# EasyEDA Pro project 烟雾报警.eprj

# Schematic 透传报警原理图
Board Name: Board2; Create Date: 2025-03-01; Company: 重庆理工大学; Drawed: 吴振伟
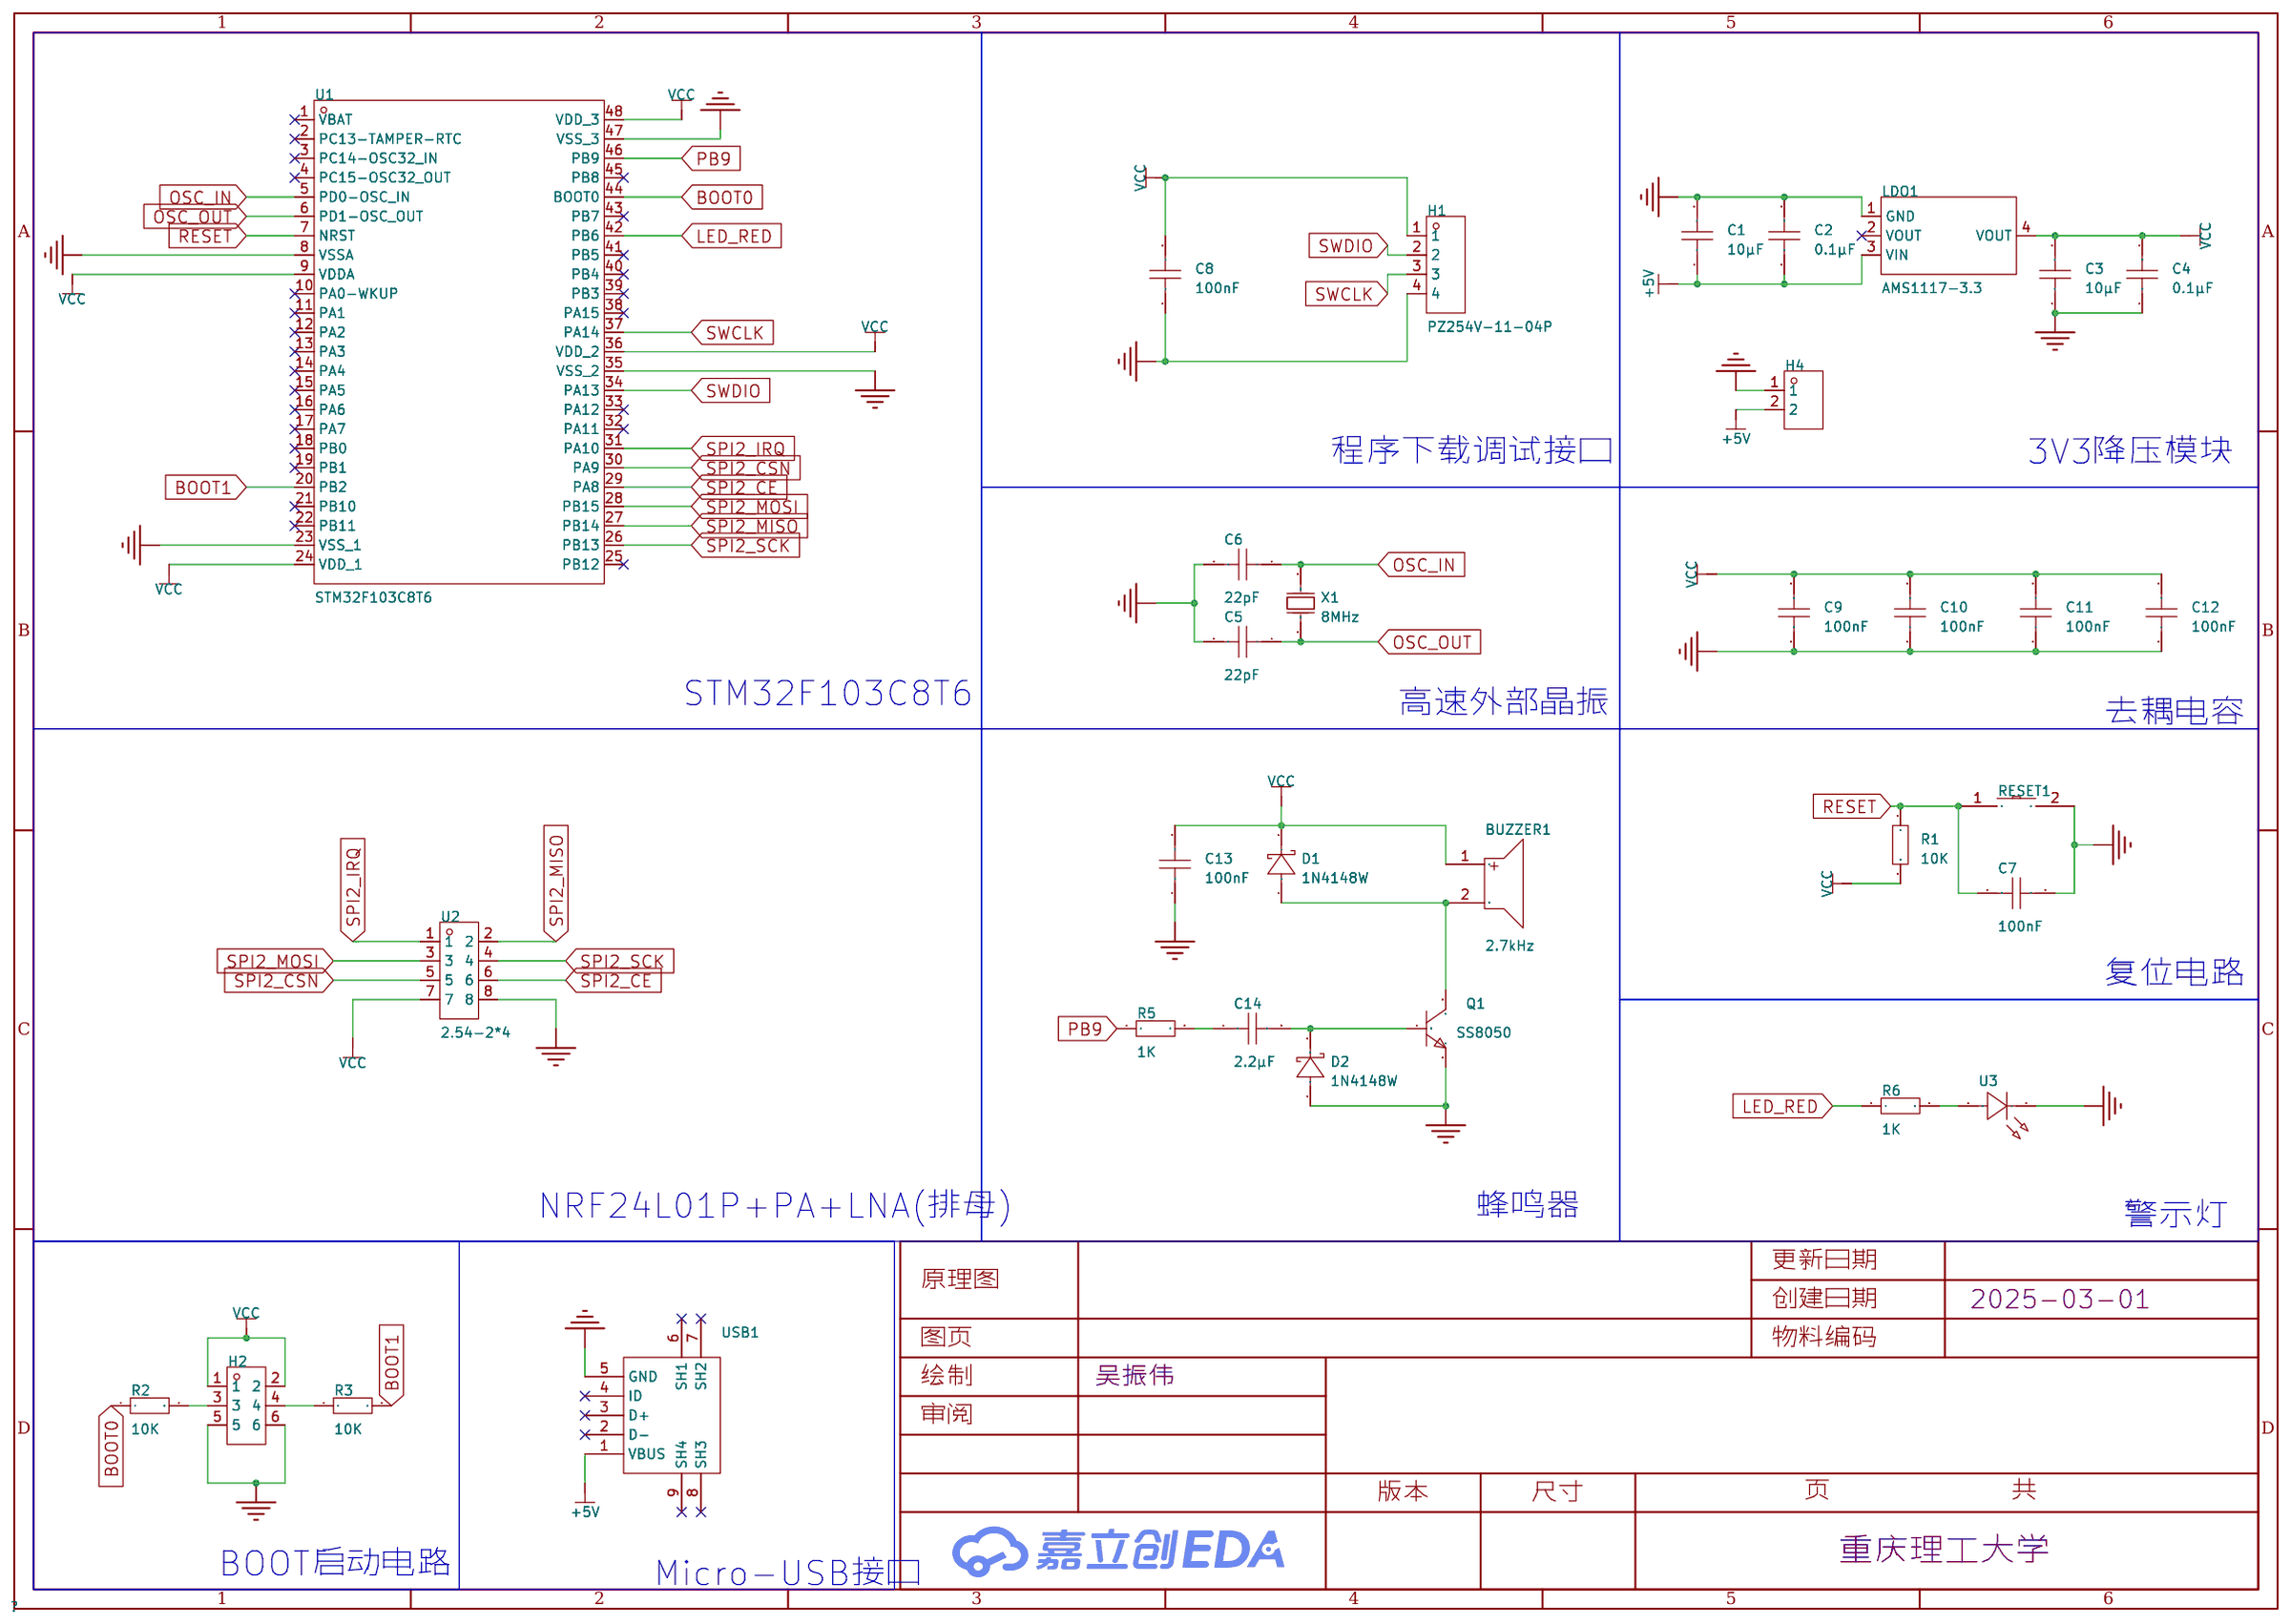
[diagram p0: schematic sheet]

## Parts
BUZZER1  2.7kHz  [BUZ-TH_BD9.0-P4.00-D0.6-FD]
C1  10μF  [C0603]
C2  0.1μF  [C0603]
C3  10μF  [C0603]
C4  0.1μF  [C0603]
C5  22pF  [C0603]
C6  22pF  [C0603]
C7  100nF  [C0603]
C8  100nF  [C0603]
C9  100nF  [C0603]
C10  100nF  [C0603]
C11  100nF  [C0603]
C12  100nF  [C0603]
C13  100nF  [C0603]
C14  2.2μF  [C0603]
D1  1N4148W  [SOD-123_L2.7-W1.6-LS3.7-FD]
D2  1N4148W  [SOD-123_L2.7-W1.6-LS3.7-FD]
H1  PZ254V-11-04P  [HDR-TH_4P-P2.54-V-M]
H2  PZ2.54-2x3-11.2  [HDR-TH_6P-P2.54-V-M-R2-C3-S2.54]
H4  PZ254V-11-02P  [HDR-TH_2P-P2.54-V-M]
LDO1  AMS1117-3.3  [SOT-223-3_L6.5-W3.4-P2.30-LS7.0-BR]
Q1  SS8050  [SOT-23-3_L2.9-W1.3-P1.90-LS2.4-BR]
R1  10K  [R0603]
R2  10K  [R0603]
R3  10K  [R0603]
R5  1K  [R0603]
R6  1K  [R0603]
RESET1  TS-1101-C-W  [SW-SMD_L6.0-W3.3-LS8.0]
U1  STM32F103C8T6  [LQFP-48_L7.0-W7.0-P0.50-LS9.0-BL]
U2  2.54-2*4  [HDR-TH_8P-P2.54-V-F-R2-C4-S2.54]
U3  XL-TD2012SURC  [LED0805-RD_RED]
USB1  MicroXNJ  [MICRO-USB-SMD_MICROXNJ]
X1  8MHz  [CRYSTAL-SMD_L5.0-W3.2]

## Library data of the parts
BUZZER1 = QMB-09B-03: 驱动方式:无源(外部驱动);构造类型:电磁式;频率:2.7kHz;声压(SPL):85dB;; LCSC Part Name: 无源蜂鸣器QMB-09B-03; Supplier Part: C96256; Manufacturer: 华能; Supplier Footprint: 插件,D=9mm; JLCPCB Part Class: 扩展库; Datasheet: https://atta.szlcsc.com/upload/public/pdf/source/20210401/C96256_958B17753B5AD7CBFBCFFC7C095B4484.pdf; Supplier: LCSC; Driver Circuitry: 无源(外部驱动); Technology: 电磁式; Voltage - Supply: 2V~5V; Sound Pressure Level(SPL): 85dB; Diameter(φD): 9mm; Height: 5.7mm
C1-C14 = CAP_0603: Supplier Footprint: 0603
D1 D2 = 1N4148W_C7420318: 二极管配置:独立式;正向压降(Vf):1.25V@150mA;直流反向耐压(Vr):100V;整流电流:150mA;反向恢复时间(trr):4ns;; Supplier Part: C7420318; Manufacturer: 宏迦橙; Supplier Footprint: SOD-123; JLCPCB Part Class: 扩展库; Datasheet: https://atta.szlcsc.com/upload/public/pdf/source/20230828/E5C3F7A4272052930A7E03B75759BF50.pdf; Supplier: LCSC; Diode Configuration: 独立式; Forward Voltage (Vf@If): 1.25V@150mA; Reverse Voltage (Vr): 100V; Rectified Current: 150mA; Reverse Leakage Current (Ir): 1uA@75V; Reverse Recovery Time (trr): 4ns; Operating Temperature: -55℃~+150℃
H1 = PZ254V-11-04P: 插针结构:1x4P;间距:2.54mm;行距:-;圆针/方针:方针;安装类型:直插;排数:单排;总PIN位数:4P;额定电流:3A;额定电压:250V;配合针长度:6mm;塑高:2.5mm;端接针长度:3mm;触头材质:-;工作温度范围:-40℃~+105℃;颜色:黑色;; LCSC Part Name: 间距:2.54mm 1x4P 直插 方针; Supplier Part: C2691448; Manufacturer: XFCN(兴飞); Supplier Footprint: 插件,P=2.54mm; JLCPCB Part Class: 扩展库; Datasheet: https://atta.szlcsc.com/upload/public/pdf/source/20200309/C492403_F9F19131791D08044AD4F84F8E751A34.pdf; Supplier: LCSC; Pin Structure: 1x4P; Pitch: 2.54mm; Circluar Pins/Square Pins: 方针; Mounting Type: 直插; Number of Rows: 单排; Number of Pins: 4P; Current Rating (Max): 3A; Voltage Rating (Max): 250V; Length of Mating Pin: 6mm; Insulation Height: 2.5mm; Length of End Connection Pin: 3mm; Operating Temperature Range: -40℃~+105℃; Color: 黑色
H2 = PZ2.54-2x3-11.2: LCSC Part Name: 排针 2*3 2.54 11.2MM; Supplier Part: C29779988; Manufacturer: ZHOURI(洲日); Supplier Footprint: 插件,P=2.54mm; JLCPCB Part Class: 扩展库; Datasheet: https://atta.szlcsc.com/upload/public/pdf/source/20240716/32C05CE2216495DDDE0C72C1E62EDEE1.pdf; Supplier: LCSC
H4 = PZ254V-11-02P: 插针结构:1x2P;间距:2.54mm;行距:-;圆针/方针:方针;安装类型:直插;排数:单排;总PIN位数:2P;额定电流:-;额定电压:-;配合针长度:6mm;塑高:2.5mm;端接针长度:3mm;触头材质:黄铜;触头镀层:-;工作温度范围:-40℃~+105℃;颜色:黑色;; LCSC Part Name: 间距:2.54mm 1x2P 直插 方针; Supplier Part: C492401; Manufacturer: XFCN(兴飞); Supplier Footprint: 插件,P=2.54mm; JLCPCB Part Class: 扩展库; Datasheet: https://atta.szlcsc.com/upload/public/pdf/source/20200309/C492401_A812433581A9B211A7FFA413ADDFF0E5.pdf; Supplier: LCSC; Pin Structure: 1x2P; Pitch: 2.54mm; Circluar Pins/Square Pins: 方针; Mounting Type: 直插; Number of Rows: 单排; Number of Pins: 2P; Length of Mating Pin: 6mm; Insulation Height: 2.5mm; Length of End Connection Pin: 3mm; Contact Material: 黄铜; Operating Temperature Range: -40℃~+105℃; Color: 黑色
LDO1 = AMS1117-3.3_C6186: 输出类型:固定;工作电压:-;输出电压:3.3V;输出电流:1A;电源纹波抑制比(PSRR):72dB@(120Hz);输出极性:正极;; LCSC Part Name: 输出3.3V 1A; Supplier Part: C6186; Manufacturer: AMS; Supplier Footprint: SOT-223; JLCPCB Part Class: 基础库; Datasheet: https://atta.szlcsc.com/upload/public/pdf/source/20180727/C6186_7A095716F0823C02F1997A905E26C086.pdf; Supplier: LCSC; Output Type: 固定; Output Voltage: 3.3V; Output Current: 1A; Power Supply Rejection Ratio (PSRR): 72dB@(120Hz); Voltage Dropout: 1.3V@(800mA); Features: 过流保护(OCP)；热保护(TSD); Output Configuration: 正极; Number of Outputs: 1
Q1 = SS8050_C7420370: 晶体管类型:NPN;集电极电流(Ic):1.5A;集射极击穿电压(Vceo):25V;耗散功率(Pd):300mW;直流电流增益(hFE):120@100mA,1.0V;; LCSC Part Name: H档 200-350; Supplier Part: C7420370; Manufacturer: 宏嘉诚; Supplier Footprint: SOT-23; JLCPCB Part Class: 扩展库; Datasheet: https://atta.szlcsc.com/upload/public/pdf/source/20250205/5DB94E86981B5B1A1866D18E379C0D4F.pdf; Supplier: LCSC; type: NPN; Current - Collector(Ic): 1.5A; Collector - Emitter Voltage VCEO: 25V; Pd - Power Dissipation: 300mW; DC Current Gain: 120@100mA,1.0V; Transition frequency(fT): 100MHz; Current - Collector Cutoff: 100nA; Vce Saturation(VCE(sat)): 500mV; Operating Temperature: -55℃~+150℃
R1-R3 R5 R6 = Res_0603: Supplier Footprint: 0603
RESET1 = TS-1101-C-W: 电路结构:单刀单掷;按钮形状:矩形按钮;作用力:260gf;安装方式:立贴;开关长度:6mm;开关宽度:3.6mm;开关高度:2.5mm;带支架:不带;触点电流:50mA;额定电压(AC):-;额定电压(DC):12V;额定功率:-;绝缘电阻:-;带灯:无;机械寿命:5万次;; LCSC Part Name: 6*3.6*2.5mm 立贴 轻触开关; Supplier Part: C318938; Manufacturer: XKB Connectivity(中国星坤); Supplier Footprint: SMD; JLCPCB Part Class: 扩展库; Datasheet: https://atta.szlcsc.com/upload/public/pdf/source/20200227/C318938_C2E53B1EEDE37D980A33616AC086DE53.pdf; Supplier: LCSC; Circuit: 单刀单掷; Actuator Style: 矩形按钮; Operating Force: 260gf; Mounting Style: 立贴; Switch Length: 6mm; Switch Width: 3.6mm; Switch Height: 2.5mm; Strike Gundam: 不带; Contact Current: 50mA; Voltage Rating (DC): 12V; Actuator/Cap Color: 白色带淡绿; With Lamp: 无; Mechanical Life: 5万次; Operating Temperature: -30℃~+85℃
U1 = STM32F103C8T6: CPU内核:ARM-M3;CPU最大主频:72MHz;应用领域:-;; LCSC Part Name: 主流增强型ARM Cortex-M3 MCU，具有64 KB Flash、72 MHz CPU、电机控制、USB和CAN; Supplier Part: C8734; Manufacturer: ST(意法半导体); Supplier Footprint: LQFP-48(7x7); JLCPCB Part Class: 扩展库; Datasheet: https://atta.szlcsc.com/upload/public/pdf/source/20220812/8363ACEC51AD55ECEB84799464F7CB85.pdf; Supplier: LCSC; CPU Core: ARM-M3; CPU Maximum Speed: 72MHz; Program Storage Size: 64KB; Program Memory Type: FLASH; Number of I/O: 37; ADC (Bit): 12bit; Low Voltage Detection Threshold: 2V~3.6V
U2 = 2.54-2*4: 插孔结构:2x4P;间距:2.54mm;行距:2.54mm;圆孔/方孔:方孔;安装类型:直插;排数:双排;总孔位数:8P;额定电流:2.5A;额定电压:-;插孔方向:顶部;塑高:8.5mm;工作温度范围:-40℃~+105℃;; LCSC Part Name: 间距:2.54mm 2x4P 直插; Supplier Part: C2977588; Manufacturer: ZHOURI(洲日); Supplier Footprint: 插件,P=2.54mm; JLCPCB Part Class: 扩展库; Datasheet: https://atta.szlcsc.com/upload/public/pdf/source/20220328/363EB391BC0EB759CF231FC910753CBE.pdf; Supplier: LCSC; Holes Structure: 2x4P; Pitch: 2.54mm; Row Spacing: 2.54mm; Circular Hole / Square Hole: 方孔; Mounting Type: 直插; Number of Rows: 双排; Number of Holes: 8P; Current Rating (Max): 2.5A; Holes Direction: 顶部; Insulation Height: 8.5mm; Operating Temperature Range: -40℃~+105℃
U3 = XL-TD2012SURC: 发光颜色:红色;正向电压(VF):1.9V~2.1V;功率:55mW;正向电流:5mA;主波长:620nm~630nm;透镜颜色:无色透明透镜;发光强度:400mcd;发光角度:30°;载带方式:正贴;工作温度:-30℃~+85℃;; LCSC Part Name: 球头红; Supplier Part: C5349939; Manufacturer: XINGLIGHT(成兴光); Supplier Footprint: 0805; JLCPCB Part Class: 扩展库; Datasheet: https://atta.szlcsc.com/upload/public/pdf/source/20240218/894FF46C8AEFE14406D7194D5A29CE65.pdf; Supplier: LCSC; Emitted Color: 红色; Forward Voltage (VF): 1.9V~2.1V; Power Dissipation: 55mW; Forward Current: 5mA; Dominant Wavelength: 620nm~630nm; Lens Color: 无色透明透镜; Luminous Intensity: 400mcd; Viewing Angle: 30°; Mounting Sytle: 正贴; Operating Temperature: -30℃~+85℃
USB1 = MicroXNJ: 连接器类型:Micro-B;标准:USB 2.0;公母:母;安装方式:卧贴;触点数量:5P;端口数量:1;额定电流 - 电源:1.8A;工作温度范围:-20℃~+85℃;; LCSC Part Name: Micro-B 母 卧贴; Supplier Part: C404969; Manufacturer: SHOU HAN(首韩); Supplier Footprint: SMD; JLCPCB Part Class: 扩展库; Datasheet: https://atta.szlcsc.com/upload/public/pdf/source/20220415/2494EDFF499AF6F852F7C820374B6AF3.pdf; Supplier: LCSC; Connector Type: Micro-B; Standard: USB 2.0; Gender: 母; Mounting Style: 卧贴; Number of Contacts: 5P; Number of Ports: 1; Current Rating - Power (Max): 1.8A; Operating Temperature Range: -20℃~+85℃; Rated Voltage (Max): 30V; Connect-Disconnect Life: 5千次; Core Colour: 黑色
X1 = X50328MSB2GI: 晶振类型:贴片晶振;频率:8MHz;常温频差:±10ppm;负载电容:20pF;频率稳定度:±20ppm;; LCSC Part Name: 8MHz ±10ppm 20pF; Supplier Part: C115962; Manufacturer: YXC(扬兴晶振); Supplier Footprint: SMD5032; JLCPCB Part Class: 基础库; Datasheet: https://atta.szlcsc.com/upload/public/pdf/source/20240329/44922B0AF7B60E58E9B66993B6077277.pdf; Supplier: LCSC; Type: 贴片晶振; Normal temperature Frequency Tolerance: ±10ppm; Load Capacitance: 20pF; Frequency Stability: ±20ppm; Operating Temperature: -40℃~+85℃

## Nets
+5V: C1.1 C2.1 H4.2 LDO1.3(VIN) USB1.1(VBUS)
GND: C1.2 C2.2 C3.1 C4.1 C5.2 C6.2 C7.2 C8.1 C9.1 C10.1 C11.1 C12.1 C13.1 D2.1(A) H1.4 H2.5 H2.6 H4.1 LDO1.1(GND) Q1.2(E) RESET1.2 U1.8(VSSA) U1.23(VSS_1) U1.35(VSS_2) U1.47(VSS_3) U2.8 U3.1(K) USB1.5(GND)
VCC: BUZZER1.1 C3.2 C4.2 C8.2 C9.2 C10.2 C11.2 C12.2 C13.2 D1.2(K) H1.1 H2.1 H2.2 LDO1.4(VOUT) R1.2 U1.9(VDDA) U1.24(VDD_1) U1.36(VDD_2) U1.48(VDD_3) U2.7
BOOT0: R2.1 U1.44(BOOT0)
BOOT1: R3.2 U1.20(PB2)
LED_RED: R6.1 U1.42(PB6)
OSC_IN: C6.1 U1.5(PD0-OSC_IN) X1.2(OSC2)
OSC_OUT: C5.1 U1.6(PD1-OSC_OUT) X1.1(OSC1)
PB9: R5.1 U1.46(PB9)
RESET: C7.1 R1.1 RESET1.1 U1.7(NRST)
SPI2_CE: U1.29(PA8) U2.6
SPI2_CSN: U1.30(PA9) U2.5
SPI2_IRQ: U1.31(PA10) U2.1
SPI2_MISO: U1.27(PB14) U2.2
SPI2_MOSI: U1.28(PB15) U2.3
SPI2_SCK: U1.26(PB13) U2.4
SWCLK: H1.3 U1.37(PA14)
SWDIO: H1.2 U1.34(PA13)
$1N1293: H2.3 R2.2
$1N1294: H2.4 R3.1
$1N1742: BUZZER1.2 D1.1(A) Q1.3(C)
$1N1744: C14.1 R5.2
$1N1746: C14.2 D2.2(K) Q1.1(B)
$1N2216: R6.2 U3.2(A)

Not connected (* = marked no-connect by the designer): LDO1 2(VOUT)*; U1 1(VBAT)* 2(PC13-TAMPER-RTC)* 3(PC14-OSC32_IN)* 4(PC15-OSC32_OUT)* 10(PA0-WKUP)* 11(PA1)* 12(PA2)* 13(PA3)* 14(PA4)* 15(PA5)* 16(PA6)* 17(PA7)* 18(PB0)* 19(PB1)* 21(PB10)* 22(PB11)* 25(PB12)* 32(PA11)* 33(PA12)* 38(PA15)* 39(PB3)* 40(PB4)* 41(PB5)* 43(PB7)* 45(PB8)*; USB1 2(D-)* 3(D+)* 4(ID)* 6(SH1)* 7(SH2)* 8(SH3)* 9(SH4)*

## Notes on the sheet
- 程序下载调试接口
- 3V3降压模块
- STM32F103C8T6
- 高速外部晶振
- 去耦电容
- 复位电路
- NRF24L01P+PA+LNA(排母)
- 蜂鸣器
- 警示灯
- BOOT启动电路
- Micro-USB接口

# Schematic 检测模块原理图
Board Name: Board1; Create Date: 2025-03-01; Company: 重庆理工大学; Drawed: 吴振伟
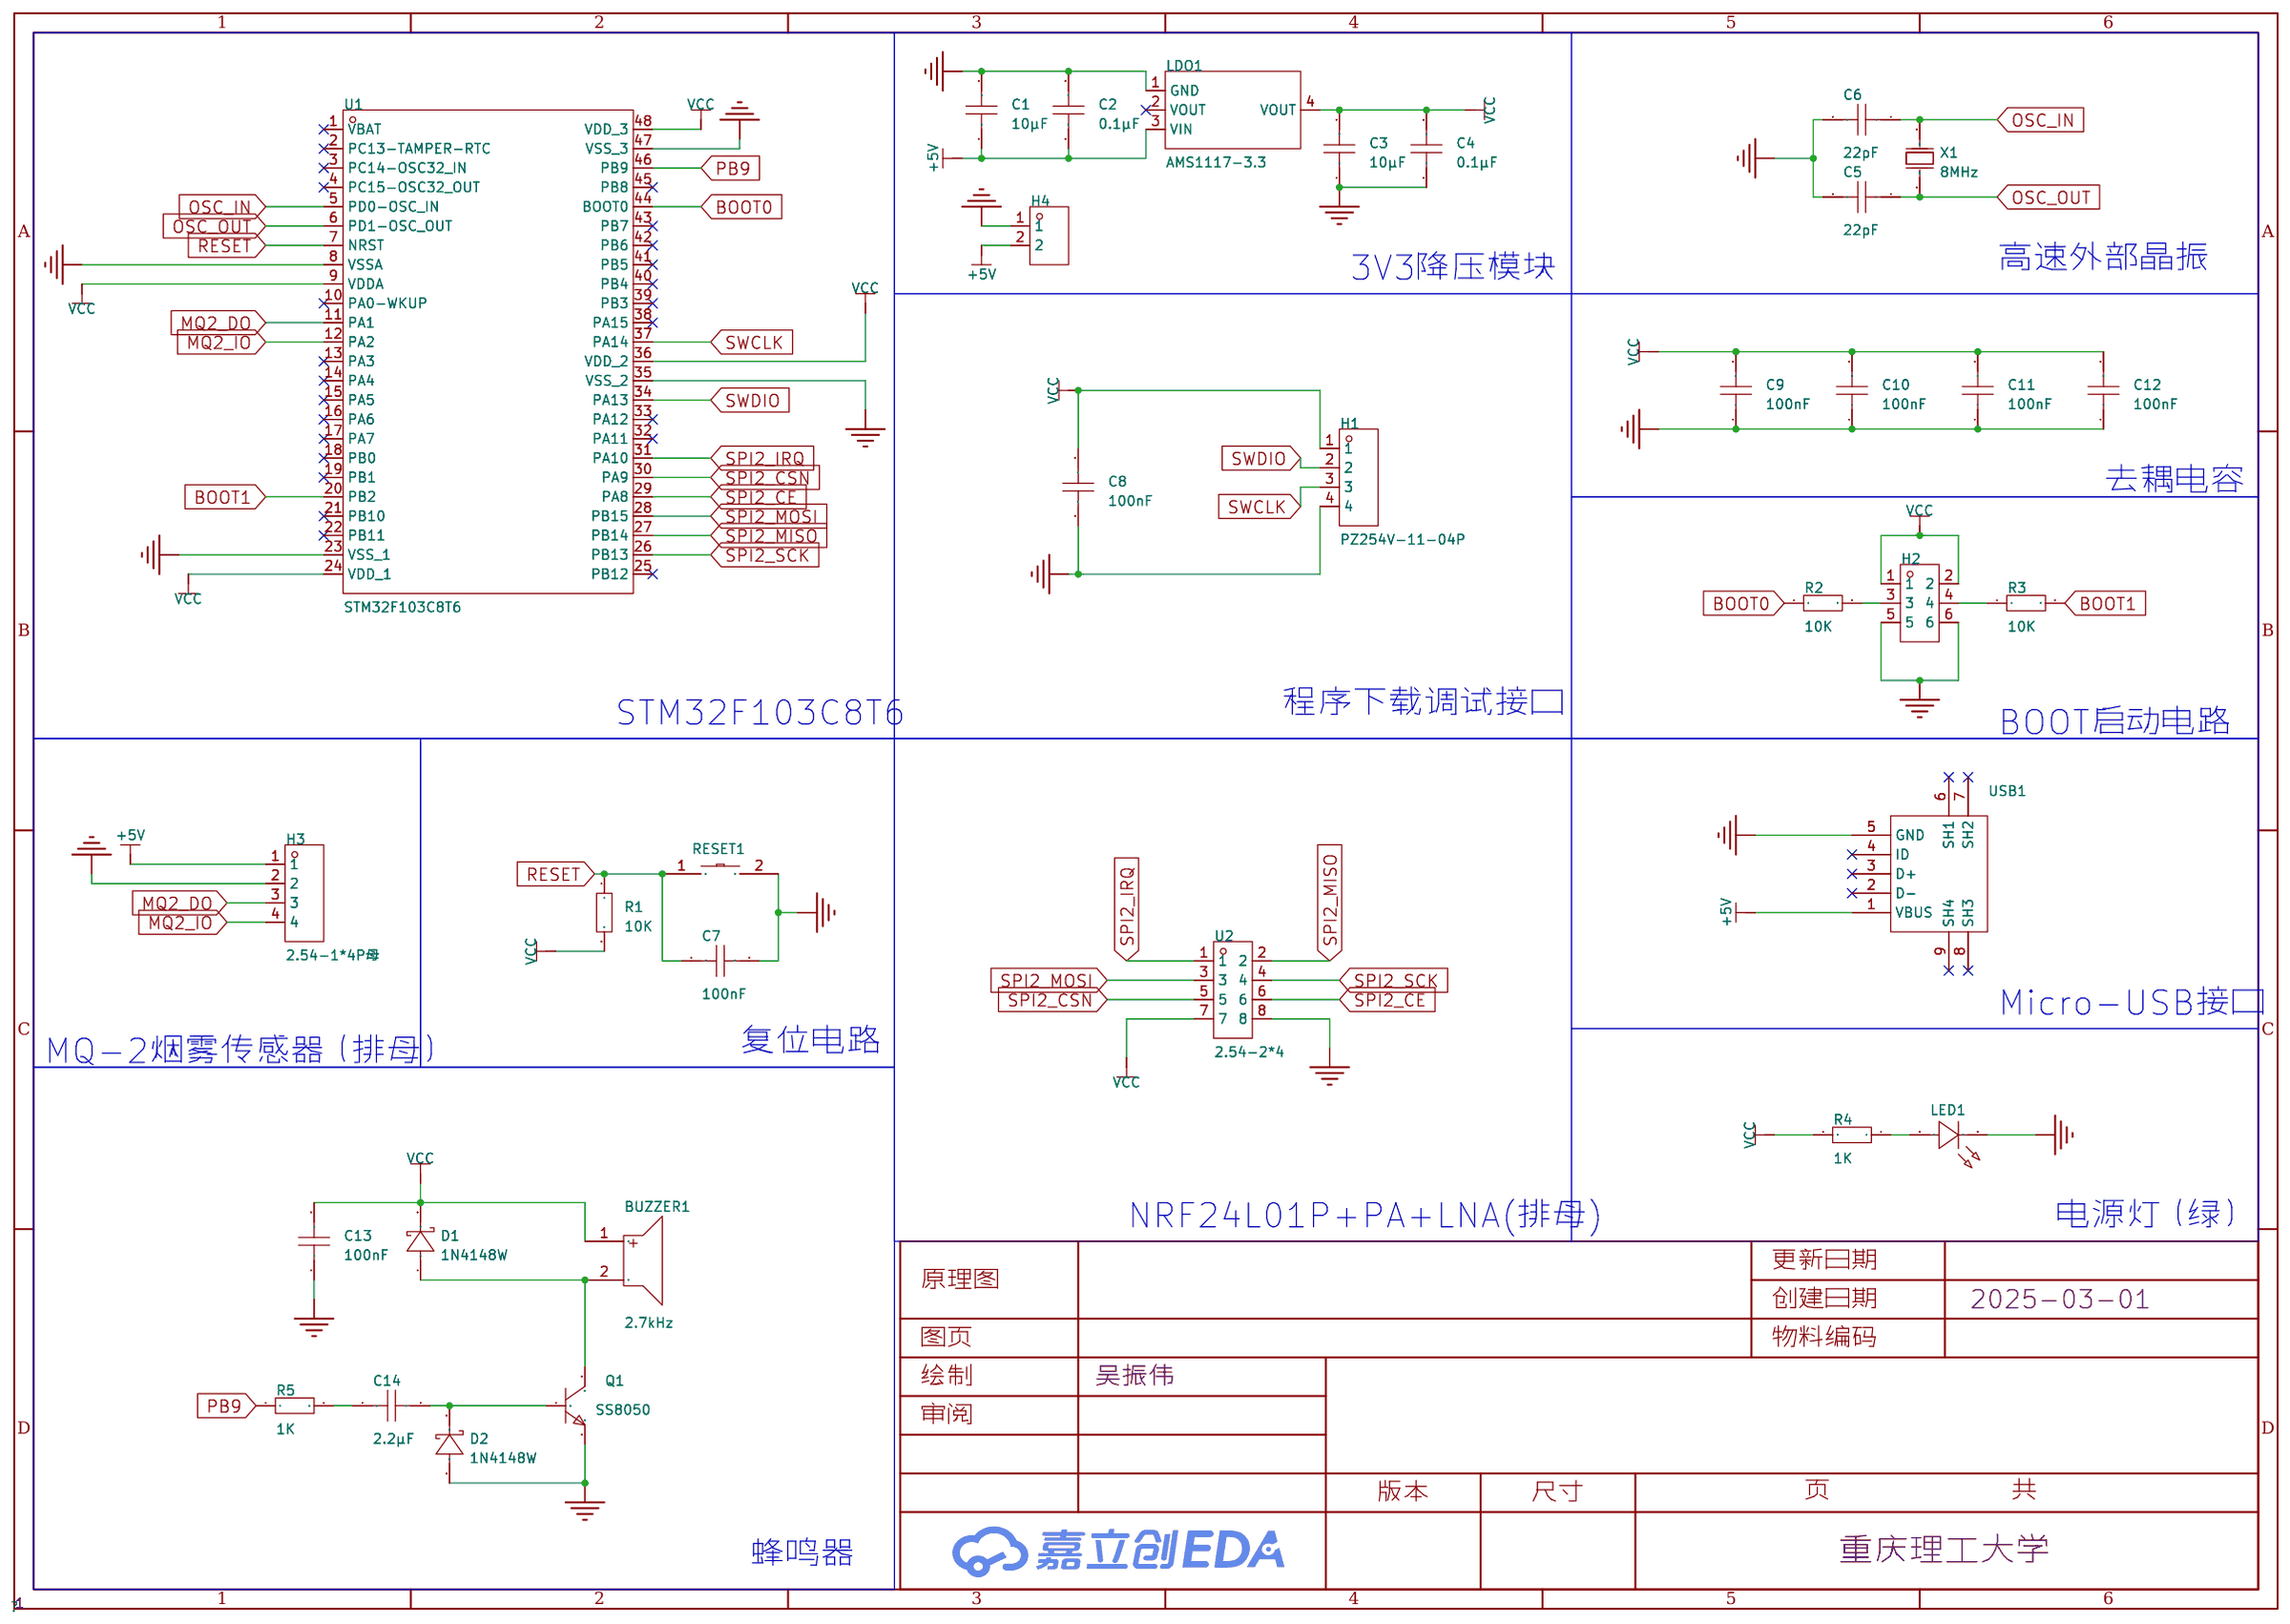
[diagram p1: schematic sheet]

## Parts
BUZZER1  2.7kHz  [BUZ-TH_BD9.0-P4.00-D0.6-FD]
C1  10μF  [C0603]
C2  0.1μF  [C0603]
C3  10μF  [C0603]
C4  0.1μF  [C0603]
C5  22pF  [C0603]
C6  22pF  [C0603]
C7  100nF  [C0603]
C8  100nF  [C0603]
C9  100nF  [C0603]
C10  100nF  [C0603]
C11  100nF  [C0603]
C12  100nF  [C0603]
C13  100nF  [C0603]
C14  2.2μF  [C0603]
D1  1N4148W  [SOD-123_L2.7-W1.6-LS3.7-FD]
D2  1N4148W  [SOD-123_L2.7-W1.6-LS3.7-FD]
H1  PZ254V-11-04P  [HDR-TH_4P-P2.54-V-M]
H2  PZ2.54-2x3-11.2  [HDR-TH_6P-P2.54-V-M-R2-C3-S2.54]
H3  2.54-1*4P母  [HDR-TH_4P-P2.54-V-F]
H4  PZ254V-11-02P  [HDR-TH_2P-P2.54-V-M]
LDO1  AMS1117-3.3  [SOT-223-3_L6.5-W3.4-P2.30-LS7.0-BR]
LED1  XL-302UGD  [LED-TH_BD3.8-P2.54-FD_GREEN]
Q1  SS8050  [SOT-23-3_L2.9-W1.3-P1.90-LS2.4-BR]
R1  10K  [R0603]
R2  10K  [R0603]
R3  10K  [R0603]
R4  1K  [R0603]
R5  1K  [R0603]
RESET1  TS-1101-C-W  [SW-SMD_L6.0-W3.3-LS8.0]
U1  STM32F103C8T6  [LQFP-48_L7.0-W7.0-P0.50-LS9.0-BL]
U2  2.54-2*4  [HDR-TH_8P-P2.54-V-F-R2-C4-S2.54]
USB1  MicroXNJ  [MICRO-USB-SMD_MICROXNJ]
X1  8MHz  [CRYSTAL-SMD_L5.0-W3.2]

## Library data of the parts
BUZZER1 = QMB-09B-03: 驱动方式:无源(外部驱动);构造类型:电磁式;频率:2.7kHz;声压(SPL):85dB;; LCSC Part Name: 无源蜂鸣器QMB-09B-03; Supplier Part: C96256; Manufacturer: 华能; Supplier Footprint: 插件,D=9mm; JLCPCB Part Class: 扩展库; Datasheet: https://atta.szlcsc.com/upload/public/pdf/source/20210401/C96256_958B17753B5AD7CBFBCFFC7C095B4484.pdf; Supplier: LCSC; Driver Circuitry: 无源(外部驱动); Technology: 电磁式; Voltage - Supply: 2V~5V; Sound Pressure Level(SPL): 85dB; Diameter(φD): 9mm; Height: 5.7mm
C1-C14 = CAP_0603: Supplier Footprint: 0603
D1 D2 = 1N4148W_C7420318: 二极管配置:独立式;正向压降(Vf):1.25V@150mA;直流反向耐压(Vr):100V;整流电流:150mA;反向恢复时间(trr):4ns;; Supplier Part: C7420318; Manufacturer: 宏迦橙; Supplier Footprint: SOD-123; JLCPCB Part Class: 扩展库; Datasheet: https://atta.szlcsc.com/upload/public/pdf/source/20230828/E5C3F7A4272052930A7E03B75759BF50.pdf; Supplier: LCSC; Diode Configuration: 独立式; Forward Voltage (Vf@If): 1.25V@150mA; Reverse Voltage (Vr): 100V; Rectified Current: 150mA; Reverse Leakage Current (Ir): 1uA@75V; Reverse Recovery Time (trr): 4ns; Operating Temperature: -55℃~+150℃
H1 = PZ254V-11-04P: 插针结构:1x4P;间距:2.54mm;行距:-;圆针/方针:方针;安装类型:直插;排数:单排;总PIN位数:4P;额定电流:3A;额定电压:250V;配合针长度:6mm;塑高:2.5mm;端接针长度:3mm;触头材质:-;工作温度范围:-40℃~+105℃;颜色:黑色;; LCSC Part Name: 间距:2.54mm 1x4P 直插 方针; Supplier Part: C2691448; Manufacturer: XFCN(兴飞); Supplier Footprint: 插件,P=2.54mm; JLCPCB Part Class: 扩展库; Datasheet: https://atta.szlcsc.com/upload/public/pdf/source/20200309/C492403_F9F19131791D08044AD4F84F8E751A34.pdf; Supplier: LCSC; Pin Structure: 1x4P; Pitch: 2.54mm; Circluar Pins/Square Pins: 方针; Mounting Type: 直插; Number of Rows: 单排; Number of Pins: 4P; Current Rating (Max): 3A; Voltage Rating (Max): 250V; Length of Mating Pin: 6mm; Insulation Height: 2.5mm; Length of End Connection Pin: 3mm; Operating Temperature Range: -40℃~+105℃; Color: 黑色
H2 = PZ2.54-2x3-11.2: LCSC Part Name: 排针 2*3 2.54 11.2MM; Supplier Part: C29779988; Manufacturer: ZHOURI(洲日); Supplier Footprint: 插件,P=2.54mm; JLCPCB Part Class: 扩展库; Datasheet: https://atta.szlcsc.com/upload/public/pdf/source/20240716/32C05CE2216495DDDE0C72C1E62EDEE1.pdf; Supplier: LCSC
H3 = 2.54-1*4P母: 插孔结构:1x4P;间距:2.54mm;行距:-;圆孔/方孔:方孔;安装类型:直插;排数:单排;总孔位数:4P;额定电流:3A;额定电压:-;插孔方向:顶部;塑高:-;触头材质:青铜;触头镀层:-;工作温度范围:-40℃~+105℃;焊接温度(最大值):-;; LCSC Part Name: 间距:2.54mm 1x4P 直插; Supplier Part: C2718488; Manufacturer: BOOMELE(博穆精密); Supplier Footprint: 插件,P=2.54mm; JLCPCB Part Class: 扩展库; Datasheet: https://atta.szlcsc.com/upload/public/pdf/source/20210301/C2718488_F4427B881E42CAA8DDB0B1C12B3A522C.pdf; Supplier: LCSC; Holes Structure: 1x4P; Pitch: 2.54mm; Circular Hole / Square Hole: 方孔; Mounting Type: 直插; Number of Rows: 单排; Number of Holes: 4P; Current Rating (Max): 3A; Holes Direction: 顶部; Contact Material: 青铜; Operating Temperature Range: -40℃~+105℃
H4 = PZ254V-11-02P: 插针结构:1x2P;间距:2.54mm;行距:-;圆针/方针:方针;安装类型:直插;排数:单排;总PIN位数:2P;额定电流:-;额定电压:-;配合针长度:6mm;塑高:2.5mm;端接针长度:3mm;触头材质:黄铜;触头镀层:-;工作温度范围:-40℃~+105℃;颜色:黑色;; LCSC Part Name: 间距:2.54mm 1x2P 直插 方针; Supplier Part: C492401; Manufacturer: XFCN(兴飞); Supplier Footprint: 插件,P=2.54mm; JLCPCB Part Class: 扩展库; Datasheet: https://atta.szlcsc.com/upload/public/pdf/source/20200309/C492401_A812433581A9B211A7FFA413ADDFF0E5.pdf; Supplier: LCSC; Pin Structure: 1x2P; Pitch: 2.54mm; Circluar Pins/Square Pins: 方针; Mounting Type: 直插; Number of Rows: 单排; Number of Pins: 2P; Length of Mating Pin: 6mm; Insulation Height: 2.5mm; Length of End Connection Pin: 3mm; Contact Material: 黄铜; Operating Temperature Range: -40℃~+105℃; Color: 黑色
LDO1 = AMS1117-3.3_C6186: 输出类型:固定;工作电压:-;输出电压:3.3V;输出电流:1A;电源纹波抑制比(PSRR):72dB@(120Hz);输出极性:正极;; LCSC Part Name: 输出3.3V 1A; Supplier Part: C6186; Manufacturer: AMS; Supplier Footprint: SOT-223; JLCPCB Part Class: 基础库; Datasheet: https://atta.szlcsc.com/upload/public/pdf/source/20180727/C6186_7A095716F0823C02F1997A905E26C086.pdf; Supplier: LCSC; Output Type: 固定; Output Voltage: 3.3V; Output Current: 1A; Power Supply Rejection Ratio (PSRR): 72dB@(120Hz); Voltage Dropout: 1.3V@(800mA); Features: 过流保护(OCP)；热保护(TSD); Output Configuration: 正极; Number of Outputs: 1
LED1 = XL-302UGD: 灯头类型:3mm圆形灯头;发光颜色:翠绿色;功率:80mW;正向电流:30mA;主波长:510nm~520nm;透镜颜色:绿色透镜;色温:-;发光角度:50°;载带方式:-;工作温度:-25℃~+85℃;; Supplier Part: C2895476; Manufacturer: XINGLIGHT(成兴光); Supplier Footprint: 插件,D=3mm; JLCPCB Part Class: 扩展库; Datasheet: https://atta.szlcsc.com/upload/public/pdf/source/20240112/A4C1FE2F91E20BD07CDB872CEF78D7A0.pdf; Supplier: LCSC; Lamp Holder Type: 3mm圆形灯头; Emitted Color: 翠绿色; Power Dissipation: 80mW; Forward Current: 30mA; Dominant Wavelength: 510nm~520nm; Peak Wavelength: 525nm; Lens Color: 绿色透镜; Viewing Angle: 50°; Operating Temperature: -25℃~+85℃
Q1 = SS8050_C7420370: 晶体管类型:NPN;集电极电流(Ic):1.5A;集射极击穿电压(Vceo):25V;耗散功率(Pd):300mW;直流电流增益(hFE):120@100mA,1.0V;; LCSC Part Name: H档 200-350; Supplier Part: C7420370; Manufacturer: 宏嘉诚; Supplier Footprint: SOT-23; JLCPCB Part Class: 扩展库; Datasheet: https://atta.szlcsc.com/upload/public/pdf/source/20250205/5DB94E86981B5B1A1866D18E379C0D4F.pdf; Supplier: LCSC; type: NPN; Current - Collector(Ic): 1.5A; Collector - Emitter Voltage VCEO: 25V; Pd - Power Dissipation: 300mW; DC Current Gain: 120@100mA,1.0V; Transition frequency(fT): 100MHz; Current - Collector Cutoff: 100nA; Vce Saturation(VCE(sat)): 500mV; Operating Temperature: -55℃~+150℃
R1-R5 = Res_0603: Supplier Footprint: 0603
RESET1 = TS-1101-C-W: 电路结构:单刀单掷;按钮形状:矩形按钮;作用力:260gf;安装方式:立贴;开关长度:6mm;开关宽度:3.6mm;开关高度:2.5mm;带支架:不带;触点电流:50mA;额定电压(AC):-;额定电压(DC):12V;额定功率:-;绝缘电阻:-;带灯:无;机械寿命:5万次;; LCSC Part Name: 6*3.6*2.5mm 立贴 轻触开关; Supplier Part: C318938; Manufacturer: XKB Connectivity(中国星坤); Supplier Footprint: SMD; JLCPCB Part Class: 扩展库; Datasheet: https://atta.szlcsc.com/upload/public/pdf/source/20200227/C318938_C2E53B1EEDE37D980A33616AC086DE53.pdf; Supplier: LCSC; Circuit: 单刀单掷; Actuator Style: 矩形按钮; Operating Force: 260gf; Mounting Style: 立贴; Switch Length: 6mm; Switch Width: 3.6mm; Switch Height: 2.5mm; Strike Gundam: 不带; Contact Current: 50mA; Voltage Rating (DC): 12V; Actuator/Cap Color: 白色带淡绿; With Lamp: 无; Mechanical Life: 5万次; Operating Temperature: -30℃~+85℃
U1 = STM32F103C8T6: CPU内核:ARM-M3;CPU最大主频:72MHz;应用领域:-;; LCSC Part Name: 主流增强型ARM Cortex-M3 MCU，具有64 KB Flash、72 MHz CPU、电机控制、USB和CAN; Supplier Part: C8734; Manufacturer: ST(意法半导体); Supplier Footprint: LQFP-48(7x7); JLCPCB Part Class: 扩展库; Datasheet: https://atta.szlcsc.com/upload/public/pdf/source/20220812/8363ACEC51AD55ECEB84799464F7CB85.pdf; Supplier: LCSC; CPU Core: ARM-M3; CPU Maximum Speed: 72MHz; Program Storage Size: 64KB; Program Memory Type: FLASH; Number of I/O: 37; ADC (Bit): 12bit; Low Voltage Detection Threshold: 2V~3.6V
U2 = 2.54-2*4: 插孔结构:2x4P;间距:2.54mm;行距:2.54mm;圆孔/方孔:方孔;安装类型:直插;排数:双排;总孔位数:8P;额定电流:2.5A;额定电压:-;插孔方向:顶部;塑高:8.5mm;工作温度范围:-40℃~+105℃;; LCSC Part Name: 间距:2.54mm 2x4P 直插; Supplier Part: C2977588; Manufacturer: ZHOURI(洲日); Supplier Footprint: 插件,P=2.54mm; JLCPCB Part Class: 扩展库; Datasheet: https://atta.szlcsc.com/upload/public/pdf/source/20220328/363EB391BC0EB759CF231FC910753CBE.pdf; Supplier: LCSC; Holes Structure: 2x4P; Pitch: 2.54mm; Row Spacing: 2.54mm; Circular Hole / Square Hole: 方孔; Mounting Type: 直插; Number of Rows: 双排; Number of Holes: 8P; Current Rating (Max): 2.5A; Holes Direction: 顶部; Insulation Height: 8.5mm; Operating Temperature Range: -40℃~+105℃
USB1 = MicroXNJ: 连接器类型:Micro-B;标准:USB 2.0;公母:母;安装方式:卧贴;触点数量:5P;端口数量:1;额定电流 - 电源:1.8A;工作温度范围:-20℃~+85℃;; LCSC Part Name: Micro-B 母 卧贴; Supplier Part: C404969; Manufacturer: SHOU HAN(首韩); Supplier Footprint: SMD; JLCPCB Part Class: 扩展库; Datasheet: https://atta.szlcsc.com/upload/public/pdf/source/20220415/2494EDFF499AF6F852F7C820374B6AF3.pdf; Supplier: LCSC; Connector Type: Micro-B; Standard: USB 2.0; Gender: 母; Mounting Style: 卧贴; Number of Contacts: 5P; Number of Ports: 1; Current Rating - Power (Max): 1.8A; Operating Temperature Range: -20℃~+85℃; Rated Voltage (Max): 30V; Connect-Disconnect Life: 5千次; Core Colour: 黑色
X1 = X50328MSB2GI: 晶振类型:贴片晶振;频率:8MHz;常温频差:±10ppm;负载电容:20pF;频率稳定度:±20ppm;; LCSC Part Name: 8MHz ±10ppm 20pF; Supplier Part: C115962; Manufacturer: YXC(扬兴晶振); Supplier Footprint: SMD5032; JLCPCB Part Class: 基础库; Datasheet: https://atta.szlcsc.com/upload/public/pdf/source/20240329/44922B0AF7B60E58E9B66993B6077277.pdf; Supplier: LCSC; Type: 贴片晶振; Normal temperature Frequency Tolerance: ±10ppm; Load Capacitance: 20pF; Frequency Stability: ±20ppm; Operating Temperature: -40℃~+85℃

## Nets
+5V: C1.1 C2.1 H3.1 H4.2 LDO1.3(VIN) USB1.1(VBUS)
GND: C1.2 C2.2 C3.1 C4.1 C5.2 C6.2 C7.2 C8.1 C9.1 C10.1 C11.1 C12.1 C13.1 D2.1(A) H1.4 H2.5 H2.6 H3.2 H4.1 LDO1.1(GND) LED1.2(K) Q1.2(E) RESET1.2 U1.8(VSSA) U1.23(VSS_1) U1.35(VSS_2) U1.47(VSS_3) U2.8 USB1.5(GND)
VCC: BUZZER1.1 C3.2 C4.2 C8.2 C9.2 C10.2 C11.2 C12.2 C13.2 D1.2(K) H1.1 H2.1 H2.2 LDO1.4(VOUT) R1.2 R4.2 U1.9(VDDA) U1.24(VDD_1) U1.36(VDD_2) U1.48(VDD_3) U2.7
BOOT0: R2.1 U1.44(BOOT0)
BOOT1: R3.2 U1.20(PB2)
MQ2_DO: H3.3 U1.11(PA1)
MQ2_IO: H3.4 U1.12(PA2)
OSC_IN: C6.1 U1.5(PD0-OSC_IN) X1.2(OSC2)
OSC_OUT: C5.1 U1.6(PD1-OSC_OUT) X1.1(OSC1)
PB9: R5.1 U1.46(PB9)
RESET: C7.1 R1.1 RESET1.1 U1.7(NRST)
SPI2_CE: U1.29(PA8) U2.6
SPI2_CSN: U1.30(PA9) U2.5
SPI2_IRQ: U1.31(PA10) U2.1
SPI2_MISO: U1.27(PB14) U2.2
SPI2_MOSI: U1.28(PB15) U2.3
SPI2_SCK: U1.26(PB13) U2.4
SWCLK: H1.3 U1.37(PA14)
SWDIO: H1.2 U1.34(PA13)
$1N2484: H2.3 R2.2
$1N2488: H2.4 R3.1
$1N2709: LED1.1(A) R4.1
$1N3392: BUZZER1.2 D1.1(A) Q1.3(C)
$1N3524: C14.2 D2.2(K) Q1.1(B)
$1N3635: C14.1 R5.2

Not connected (* = marked no-connect by the designer): LDO1 2(VOUT)*; U1 1(VBAT)* 2(PC13-TAMPER-RTC)* 3(PC14-OSC32_IN)* 4(PC15-OSC32_OUT)* 10(PA0-WKUP)* 13(PA3)* 14(PA4)* 15(PA5)* 16(PA6)* 17(PA7)* 18(PB0)* 19(PB1)* 21(PB10)* 22(PB11)* 25(PB12)* 32(PA11)* 33(PA12)* 38(PA15)* 39(PB3)* 40(PB4)* 41(PB5)* 42(PB6)* 43(PB7)* 45(PB8)*; USB1 2(D-)* 3(D+)* 4(ID)* 6(SH1)* 7(SH2)* 8(SH3)* 9(SH4)*

## Notes on the sheet
- 高速外部晶振
- 3V3降压模块
- 去耦电容
- STM32F103C8T6
- 程序下载调试接口
- BOOT启动电路
- Micro-USB接口
- MQ-2烟雾传感器（排母）
- 复位电路
- NRF24L01P+PA+LNA(排母)
- 电源灯（绿）
- 蜂鸣器

# Board PCB1
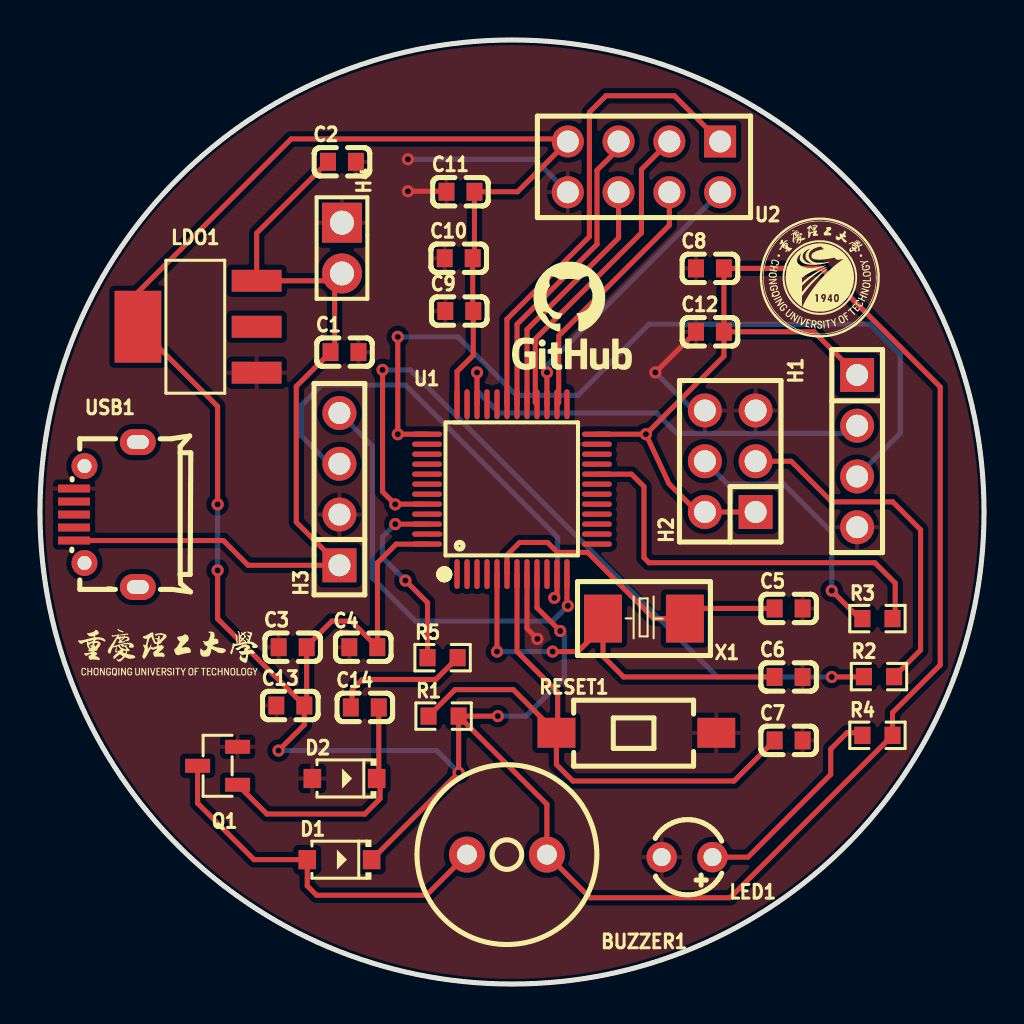
[diagram p2: board, top side]
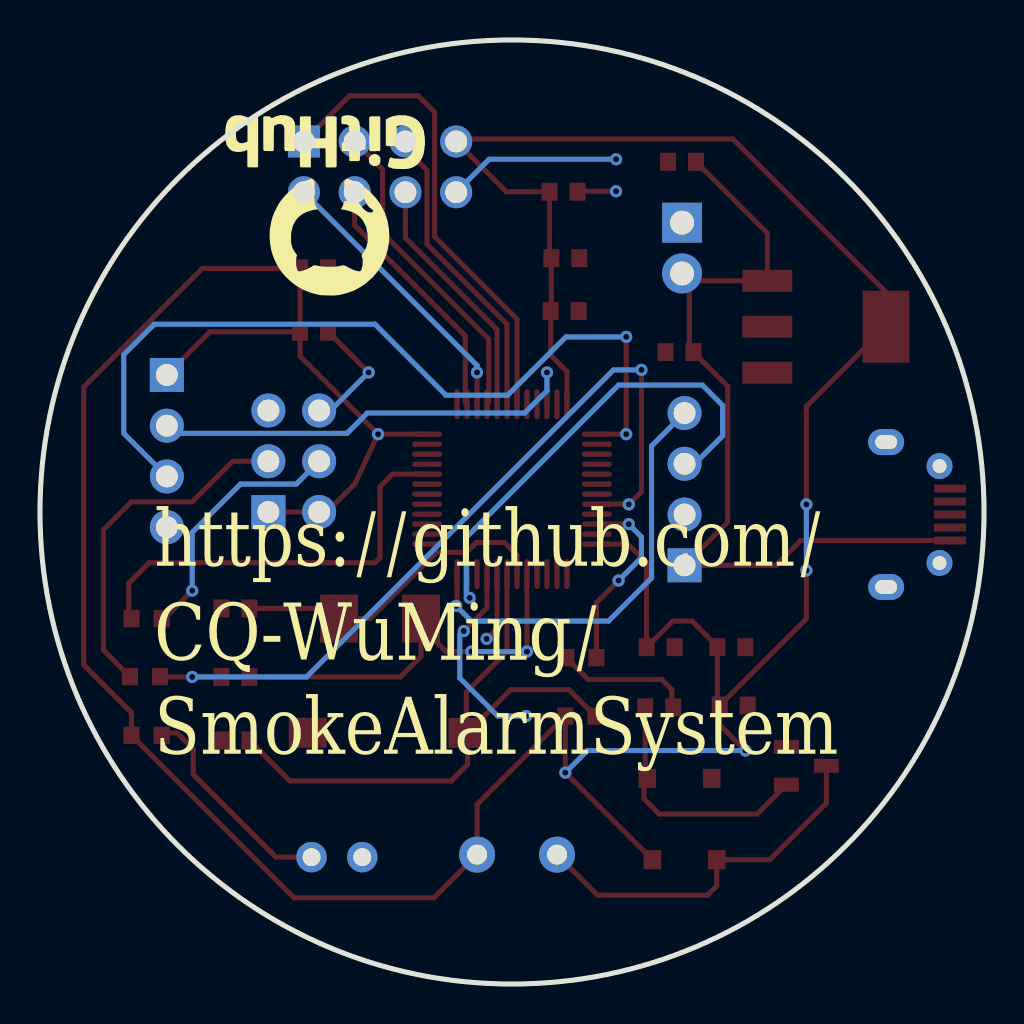
[diagram p3: board, bottom side, seen from below]

Outline 47.24 x 47.24 mm; copper layers: Top Layer, Bottom Layer. Coordinates in mm from the lower left corner of the outline.
Outline path: circle c23.62,23.62 r23.62
Stack: Top Layer 0.035mm / Dielectric1 1.51mm FR4 er 4.5 / Bottom Layer 0.035mm

## Design rules (mm)
template: JLCPCB Capability(Two Layers Board)
spacing copperThickness1oz (default): track to track 0.102, other pairs 0.152 to 0.3
spacing copperThickness2oz: track to track 0.203, other pairs 0.152 to 0.3
track width copperThickness1oz (default): min 0.127, default 0.254, max 2.54
track width copperThickness2oz: min 0.203, default 0.254, max 2.54
differential pair differentialPair (default): width min 0.127, default 0.254, max 2.54; gap min 0.152, default 0.152
via viaSize (default): diameter min 0.5, default 0.61, max 10; hole min 0.3, default 0.305, max 6.3

## Placement (name value [footprint] x y rotation side)
BUZZER1  2.7kHz  [BUZ-TH_BD9.0-P4.00-D0.6-FD]  23.37 6.48 180 top
C1  10μF  [C0603]  15.24 31.62 0 top
C2  0.1μF  [C0603]  15.11 41.15 0 top
C3  10μF  [C0603]  12.65 16.86 0 top
C4  0.1μF  [C0603]  16.18 16.86 0 top
C5  22pF  [C0603]  37.46 18.8 0 top
C6  22pF  [C0603]  37.46 15.37 0 top
C7  100nF  [C0603]  37.46 12.19 0 top
C8  100nF  [C0603]  33.53 35.81 0 top
C9  100nF  [C0603]  20.98 33.68 0 top
C10  100nF  [C0603]  20.95 36.32 0 top
C11  100nF  [C0603]  21.04 39.65 0 top
C12  100nF  [C0603]  33.53 32.64 0 top
C13  100nF  [C0603]  12.53 13.94 0 top
C14  2.2μF  [C0603]  16.26 13.84 0 top
D1  1N4148W  [SOD-123_L2.7-W1.6-LS3.7-FD]  14.99 6.22 0 top
D2  1N4148W  [SOD-123_L2.7-W1.6-LS3.7-FD]  15.24 10.29 0 top
H1  PZ254V-11-04P  [HDR-TH_4P-P2.54-V-M]  40.89 26.67 270 top
H2  PZ2.54-2x3-11.2  [HDR-TH_6P-P2.54-V-M-R2-C3-S2.54]  34.54 26.16 90 top
H3  2.54-1*4P母  [HDR-TH_4P-P2.54-V-F]  14.99 24.76 90 top
H4  PZ254V-11-02P  [HDR-TH_2P-P2.54-V-M]  15.11 36.83 270 top
LDO1  AMS1117-3.3  [SOT-223-3_L6.5-W3.4-P2.30-LS7.0-BR]  7.87 32.89 0 top
LED1  XL-302UGD  [LED-TH_BD3.8-P2.54-FD_GREEN]  32.38 6.35 180 top
Q1  SS8050  [SOT-23-3_L2.9-W1.3-P1.90-LS2.4-BR]  8.89 10.92 0 top
R1  10K  [R0603]  20.2 13.41 0 top
R2  10K  [R0603]  41.99 15.38 0 top
R3  10K  [R0603]  41.91 18.29 0 top
R4  1K  [R0603]  41.91 12.45 0 top
R5  1K  [R0603]  20.15 16.33 0 top
RESET1  TS-1101-C-W  [SW-SMD_L6.0-W3.3-LS8.0]  29.84 12.57 0 top
U1  STM32F103C8T6  [LQFP-48_L7.0-W7.0-P0.50-LS9.0-BL]  23.62 24.76 0 top
U2  2.54-2*4  [HDR-TH_8P-P2.54-V-F-R2-C4-S2.54]  30.23 40.89 180 top
USB1  MicroXNJ  [MICRO-USB-SMD_MICROXNJ]  3.3 23.49 90 top
X1  8MHz  [CRYSTAL-SMD_L5.0-W3.2]  30.23 18.29 180 top

## Footprints (pads in the part's own frame, mm; a bottom-side part is the same pattern mirrored in y, then rotated)
BUZ-TH_BD9.0-P4.00-D0.6-FD
  round 1.8 hole 1: 1(-2,0) 2(2,0)
C0603
  rect 0.8x0.9 smd: 1(-0.7,0) 2(0.7,0)
CRYSTAL-SMD_L5.0-W3.2
  rect 1.9x2.4 smd: 1(-2.05,0) 2(2.05,0)
HDR-TH_2P-P2.54-V-M
  rect 2x2 hole 1.2: 1(-1.27,0)
  round 2 hole 1.2: 2(1.27,0)
HDR-TH_4P-P2.54-V-F
  rect 1.7x1.7 hole 1.1: 1(-3.81,0)
  round 1.7 hole 1.1: 2(-1.27,0) 3(1.27,0) 4(3.81,0)
HDR-TH_4P-P2.54-V-M
  rect 1.7x1.7 hole 1.1: 1(-3.81,0)
  round 1.7 hole 1.1: 2(-1.27,0) 3(1.27,0) 4(3.81,0)
HDR-TH_6P-P2.54-V-M-R2-C3-S2.54
  rect 1.7x1.7 hole 1.1: 1(-2.54,-1.27)
  round 1.7 hole 1.1: 2(-2.54,1.27) 3(0,-1.27) 4(0,1.27) 5(2.54,-1.27) 6(2.54,1.27)
HDR-TH_8P-P2.54-V-F-R2-C4-S2.54
  rect 1.6x1.6 hole 1.1: 1(-3.81,-1.27)
  round 1.6 hole 1.1: 2(-3.81,1.27) 3(-1.27,-1.27) 4(-1.27,1.27) 5(1.27,-1.27) 6(1.27,1.27) 7(3.81,-1.27) 8(3.81,1.27)
LED-TH_BD3.8-P2.54-FD_GREEN
  round 1.524 hole 0.9: 1(-1.27,0) 2(1.27,0)
LQFP-48_L7.0-W7.0-P0.50-LS9.0-BL
  oval 0.27x1.5 smd: 1(-2.75,-4.25) 2(-2.25,-4.25) 3(-1.75,-4.25) 4(-1.25,-4.25) 5(-0.75,-4.25) 6(-0.25,-4.25) 7(0.25,-4.25) 8(0.75,-4.25) 9(1.25,-4.25) 10(1.75,-4.25) 11(2.25,-4.25) 12(2.75,-4.25) 25(2.75,4.25) 26(2.25,4.25) 27(1.75,4.25) 28(1.25,4.25) 29(0.75,4.25) 30(0.25,4.25) 31(-0.25,4.25) 32(-0.75,4.25) 33(-1.25,4.25) 34(-1.75,4.25) 35(-2.25,4.25) 36(-2.75,4.25)
  oval 1.5x0.27 smd: 13(4.25,-2.75) 14(4.25,-2.25) 15(4.25,-1.75) 16(4.25,-1.25) 17(4.25,-0.75) 18(4.25,-0.25) 19(4.25,0.25) 20(4.25,0.75) 21(4.25,1.25) 22(4.25,1.75) 23(4.25,2.25) 24(4.25,2.75) 37(-4.25,2.75) 38(-4.25,2.25) 39(-4.25,1.75) 40(-4.25,1.25) 41(-4.25,0.75) 42(-4.25,0.25) 43(-4.25,-0.25) 44(-4.25,-0.75) 45(-4.25,-1.25) 46(-4.25,-1.75) 47(-4.25,-2.25) 48(-4.25,-2.75)
MICRO-USB-SMD_MICROXNJ
  rect 0.4x1.6 smd: 1(-1.3,1.597) 2(-0.65,1.597) 3(0,1.597) 4(0.65,1.597) 5(1.3,1.597)
  round 1.3 hole 0.7: 6(2.425,1.074) 9(-2.425,1.073)
  oval 1.3x1.8 hole 0.7x1.1: 7(3.625,-1.597) 8(-3.625,-1.597)
R0603
  rect 0.806x0.864 smd: 1(-0.753,0) 2(0.753,0)
SOD-123_L2.7-W1.6-LS3.7-FD
  rect 0.88x0.96 smd: 1(-1.61,0) 2(1.61,0)
SOT-23-3_L2.9-W1.3-P1.90-LS2.4-BR
  rect 1.25x0.7 smd: 1(1,-0.95) 2(1,0.95) 3(-1,0)
SOT-223-3_L6.5-W3.4-P2.30-LS7.0-BR
  rect 2.5x1.1 smd: 1(2.97,-2.3) 2(2.97,0) 3(2.97,2.3)
  rect 2.34x3.6 smd: 4(-2.97,0)
SW-SMD_L6.0-W3.3-LS8.0
  rect 1.9x1.5 smd: 1(-4,0) 2(4,0)

## Nets
As in the schematic.

Pads without a net: LDO1 2; U1 1 2 3 4 10 13 14 15 16 17 18 19 21 22 25 32 33 38 39 40 41 42 43 45; USB1 2 3 4 6 7 8 9

## Via types
v1: diameter 0.61, hole 0.305, Top Layer to Bottom Layer, 25 vias

## Routing (per net, layer and track width the routed paths; a pad name or vN(x,y) marks a point on that pad's centre or on a via; arc(x,y) is an arc through that point)
+5V: length 41.6
  Top Layer w0.254: USB1.1 9.17,22.19 10.41,20.95 H3.1 12.83,23.11 12.83,29.91 C1.1 14.75,31.83 14.75,35.19 ; C2.1 10.84,37.58 LDO1.3 14.75,35.19 ; 14.75,35.19 H4.2
GND: length 20
  Top Layer w0.254: C11.1 20.32,39.67 v1(18.41,39.67) ; 24.76,17.4 24.37,17.79 U1.8 ; C12.1 v1(30.8,30.61)
  Bottom Layer w0.254: U2.8 24.76,41.27 v1(18.41,41.27) ; H2.6 32.7,28.7 v1(30.8,30.61)
  vias: v1(24.89,17.27)
VCC: length 203
  Top Layer w0.254: U1.36 20.87,30.65 21.68,31.46 C9.2 21.65,33.71 C10.2 21.74,36.41 C11.2 23.9,39.65 U2.7 26.29,42.29 12.57,42.29 4.9,34.62 LDO1.4 8.89,28.91 v1(8.89,24) ; R1.2 v1(22.91,13.41) ; R1.2 25.37,8.99 BUZZER1.1 27.53,4.32 34.54,4.32 R4.2 42.66,13.58 45.05,15.97 45.05,29.88 39.12,35.81 34.23,35.81 34.23,32.64 ; R1.2 v1(20.95,10.58) D1.2 ; 34.23,32.64 34.23,31.42 v1(30.32,27.51) ; 34.23,32.64 38.73,32.64 H1.1 ; C13.2 13.35,14.05 C3.2 13.35,16.9 14.6,18.16 15.57,18.16 C4.2 16.89,16.87 16.89,21.08 17.82,22.01 U1.48 ; C13.2 8.89,18.28 v1(8.89,20.7) ; C13.2 13.23,12.97 v1(11.94,11.68) ; v1(30.32,27.51) U1.24 ; v1(30.32,27.51) 31.48,25.03 32.89,23.62 H2.2 35.81,23.62 ; v1(26.03,17.67) 24.87,18.83 U1.9
  Bottom Layer w0.254: v1(22.91,13.41) 24.33,13.41 26.24,15.32 26.24,17.46 v1(26.03,17.67) ; v1(20.95,10.58) 19.85,11.68 v1(11.94,11.68) ; v1(8.89,24) v1(8.89,20.7)
BOOT0: length 38.5
  Top Layer w0.254: R2.1 41.22,15.37 v1(39.62,15.37) ; 18.03,24 18.05,24.01 U1.44 ; v1(17.14,30.73) 17.14,24.63 v1(17.78,24)
  Bottom Layer w0.254: v1(17.14,30.73) 18.54,30.73 33.91,15.37 39.37,15.37
BOOT1: length 21.1
  Top Layer w0.254: R3.2 42.8,18.42 42.8,20.07 41.78,21.08 30.48,21.08 30.23,21.34 30.23,24.89 29.6,25.51 U1.20
MQ2_DO: length 24.8
  Top Layer w0.254: v1(25.74,19.32) 25.87,19.46 U1.11
  Bottom Layer w0.254: v1(25.74,19.32) 25.91,19.49 25.91,22.35 18.29,29.97 14.1,29.97 13.08,28.96 13.08,27.43 14.48,26.03 H3.3
MQ2_IO: length 21.5
  Top Layer w0.254: U1.12 26.37,18.92
  Bottom Layer w0.254: 14.99,28.57 16.64,26.92 16.64,20.32 18.8,18.16 25.65,18.16 v1(26.42,18.92)
OSC_IN: length 20.6
  Top Layer w0.254: C6.1 29.21,15.37 28.18,16.4 28.18,17.89 ; X1.2 28.18,17.89 ; 28.18,17.89 26.92,16.64 v1(25.65,16.64) ; U1.5 v1(22.87,16.64)
  Bottom Layer w0.254: v1(22.87,16.64) v1(25.65,16.64)
OSC_OUT: length 16.4
  Top Layer w0.254: U1.6 23.37,21.47 24,22.1 25.4,22.1 25.9,21.6 27.41,21.6 30.72,18.29 X1.1 32.78,18.8 C5.1
PB9: length 9.5
  Top Layer w0.254: U1.46 v1(17.78,23.01) ; v1(18.29,20.19) 19.4,19.09 R5.1
  Bottom Layer w0.254: v1(18.29,20.19) 17.14,21.34 17.14,22.38 v1(17.78,23.01)
RESET: length 30.3
  Top Layer w0.254: RESET1.1 23.69,14.73 20.77,14.73 R1.1 ; RESET1.1 25.91,12.64 25.91,14.6 23.87,16.64 U1.7 ; RESET1.1 25.84,10.98 26.67,10.16 34.73,10.16 C7.1
SPI2_CE: length 12.5
  Top Layer w0.254: U1.29 24.37,32.75 28.96,37.34 U2.6
SPI2_CSN: length 15.3
  Top Layer w0.254: U2.5 28.96,41.8 27.88,40.73 27.88,37.02 23.87,33.02 U1.30
SPI2_IRQ: length 24.2
  Top Layer w0.254: U2.1 31.75,44.45 28.32,44.45 27.49,43.62 27.49,37.4 23.37,33.27 23.37,29.02 U1.31
SPI2_MISO: length 14.2
  Top Layer w0.254: U1.27 v1(25.37,30.6)
  Bottom Layer w0.254: v1(25.37,30.61) 25.37,30.96 U2.2
SPI2_MOSI: length 16
  Top Layer w0.254: U2.3 30.1,40.77 30.1,37.59 24.79,32.28 24.79,29.1 U1.28
SPI2_SCK: length 12.9
  Top Layer w0.254: U2.4 31.5,37.97 25.96,32.43 25.96,29.1 U1.26
SWCLK: length 41.8
  Top Layer w0.254: U1.37 v1(17.91,27.51) v1(17.91,32.38)
  Bottom Layer w0.254: H1.3 43.05,27.56 43.05,31.5 41.53,33.02 30.48,33.02 26.92,29.46 23.84,29.46 20.92,32.38 v1(17.91,32.38)
SWDIO: length 22.6
  Top Layer w0.254: U1.34 v1(21.87,30.61)
  Bottom Layer w0.254: v1(21.87,30.61) 21.87,29.69 22.99,28.57 30.86,28.57 31.88,27.56 40.51,27.56 H1.2
$1N2484: length 17.6
  Top Layer w0.254: 35.81,26.16 37.59,26.16 39.62,24.13 42.67,24.13 44.07,22.73 44.07,16.71 R2.2
$1N2488: length 12.9
  Top Layer w0.254: R3.1 41.02,18.29 v1(39.62,19.68)
  Bottom Layer w0.254: H2.4 34.42,25.02 37.21,25.02 39.62,22.61 v1(39.62,19.68)
$1N2709: length 10.9
  Top Layer w0.254: LED1.1 35.43,6.35 39.57,10.49 39.57,11.76 40.39,12.57 41.03,12.57 R4.1
$1N3392: length 18.9
  Top Layer w0.254: Q1.3 7.89,9.05 10.72,6.22 13.38,6.22 13.38,4.91 13.84,4.44 19.34,4.44 BUZZER1.2
$1N3524: length 12.7
  Top Layer w0.254: Q1.1 11.35,8.51 16.26,8.51 17.02,9.27 17.02,10.12 16.85,10.29 16.96,10.39 C14.2
$1N3635: length 6.9
  Top Layer w0.254: R5.2 19.81,15.24 16.13,15.24 15.62,14.73 15.62,13.91 C14.1

## Copper pours and planes (outline as drawn; the poured copper is in the pictures)
GND on Top Layer: 48.57,25.1 48.53,26.07 48.46,27.05 48.34,28.01 48.19,28.98 48,29.93 47.77,30.88 47.51,31.82 47.21,32.75 46.87,33.66 46.49,34.56 46.09,35.45 45.64,36.32 45.17,37.17 44.66,38 44.12,38.81 43.54,39.6 42.94,40.36 42.31,41.1 41.65,41.82 40.96,42.51 40.24,43.17 39.5,43.8 38.73,44.41 37.94,44.98 37.13,45.52 36.3,46.03 35.45,46.51 34.58,46.95 33.7,47.36 32.8,47.73 31.88,48.07 30.96,48.37 30.02,48.64 29.07,48.86 28.11,49.05 27.15,49.21 26.18,49.32 25.21,49.4 24.24,49.43 23.26,49.43 22.29,49.4 21.32,49.32 20.35,49.21 19.38,49.05 18.43,48.86 17.48,48.64 16.54,48.37 15.62,48.07 14.7,47.73 13.8,47.36 12.91,46.95 12.05,46.51 11.2,46.03 10.36,45.52 9.55,44.98 8.76,44.41 8,43.8 7.26,43.17 6.54,42.51 5.85,41.82 5.19,41.1 4.56,40.36 3.95,39.6 3.38,38.81 2.84,38 2.33,37.17 1.85,36.32 1.41,35.45 1,34.56 0.63,33.66 0.29,32.75 -0.01,31.82 -0.27,30.88 -0.5,29.93 -0.69,28.98 -0.84,28.01 -0.96,27.05 -1.03,26.07 -1.07,25.1 -1.07,24.13 -1.03,23.15 -0.96,22.18 -0.84,21.21 -0.69,20.25 -0.5,19.29 -0.27,18.34 -0.01,17.41 0.29,16.48 0.63,15.56 1,14.66 1.41,13.78 1.85,12.91 2.33,12.06 2.84,11.23 3.38,10.42 3.95,9.63 4.56,8.86 5.19,8.12 5.85,7.41 6.54,6.72 7.26,6.05 8,5.42 8.76,4.82 9.55,4.25 10.36,3.7 11.2,3.19 12.05,2.72 12.91,2.28 13.8,1.87 14.7,1.49 15.62,1.16 16.54,0.86 17.48,0.59 18.43,0.36 19.38,0.17 20.35,0.02 21.32,-0.09 22.29,-0.17 23.26,-0.21 24.24,-0.21 25.21,-0.17 26.18,-0.09 27.15,0.02 28.11,0.17 29.07,0.36 30.02,0.59 30.96,0.86 31.88,1.16 32.8,1.49 33.7,1.87 34.58,2.28 35.45,2.72 36.3,3.19 37.13,3.7 37.94,4.25 38.73,4.82 39.5,5.42 40.24,6.05 40.96,6.72 41.65,7.41 42.31,8.12 42.94,8.86 43.54,9.63 44.12,10.42 44.66,11.23 45.17,12.06 45.64,12.91 46.09,13.78 46.49,14.66 46.87,15.56 47.21,16.48 47.51,17.41 47.77,18.34 48,19.29 48.19,20.25 48.34,21.21 48.46,22.18 48.53,23.15 48.57,24.13

## Text on the board
Bottom Silkscreen Layer: https://github.com/ / CQ-WuMing/ / SmokeAlarmSystem

# Board PCB3
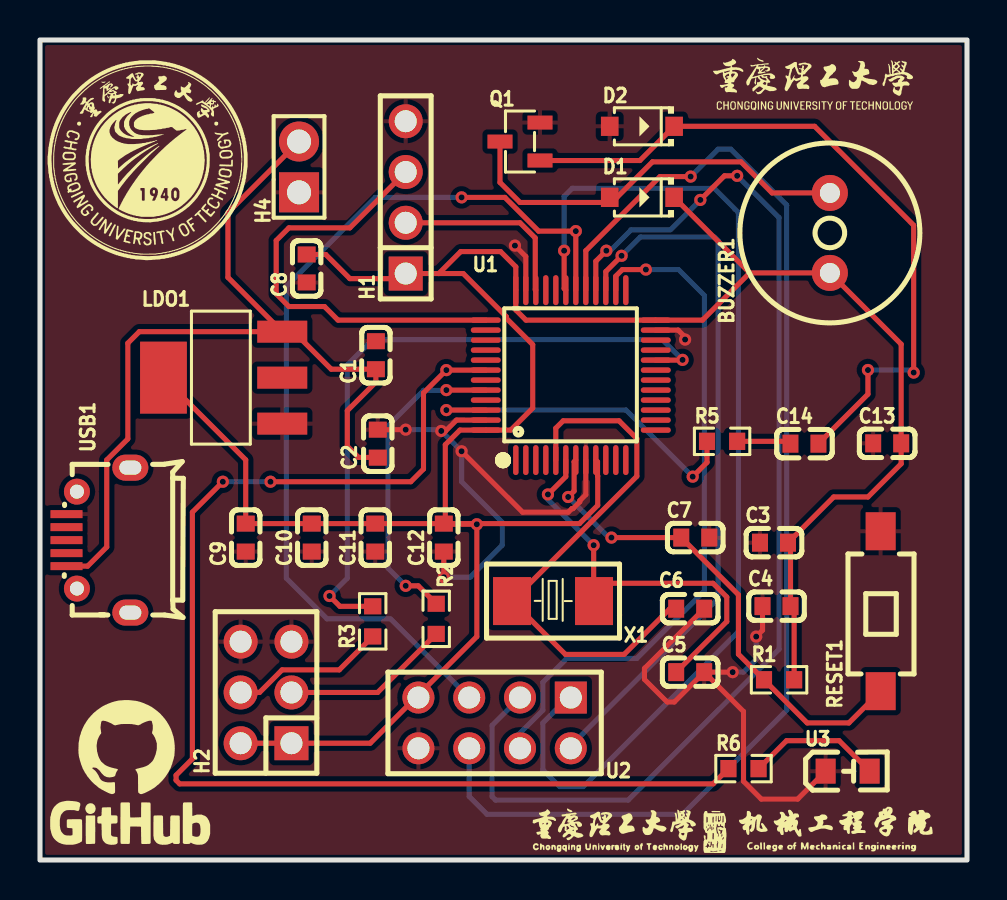
[diagram p4: board, top side]
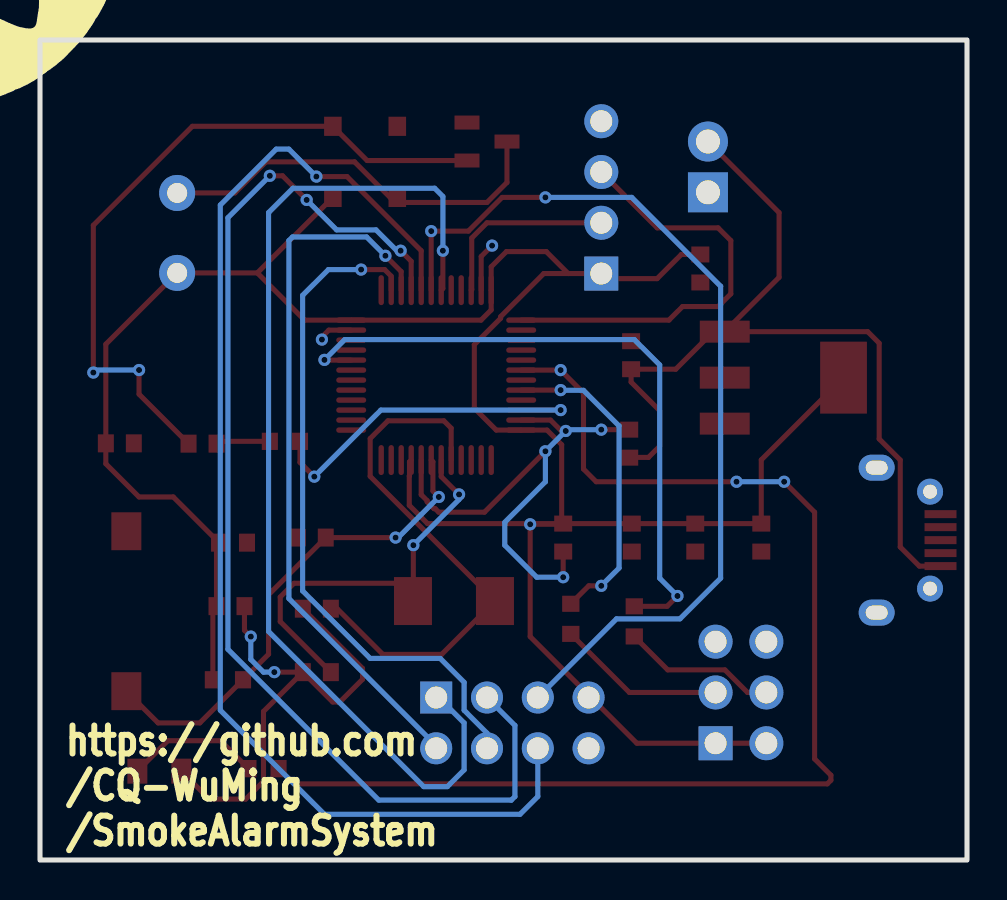
[diagram p5: board, bottom side, seen from below]

Outline 46.36 x 41.02 mm; copper layers: Top Layer, Bottom Layer. Coordinates in mm from the lower left corner of the outline.
Outline path: rectangle 0,41.02 46.36,0
Stack: Top Layer 0.035mm / Dielectric1 1.51mm FR4 er 4.5 / Bottom Layer 0.035mm

## Design rules (mm)
template: JLCPCB Capability(Two Layers Board)
spacing copperThickness1oz (default): track to track 0.102, other pairs 0.152 to 0.3
spacing copperThickness2oz: track to track 0.203, other pairs 0.152 to 0.3
track width copperThickness1oz (default): min 0.127, default 0.254, max 2.54
track width copperThickness2oz: min 0.203, default 0.254, max 2.54
differential pair differentialPair (default): width min 0.127, default 0.254, max 2.54; gap min 0.152, default 0.152
via viaSize (default): diameter min 0.5, default 0.61, max 10; hole min 0.3, default 0.305, max 6.3

## Placement (name value [footprint] x y rotation side)
BUZZER1  2.7kHz  [BUZ-TH_BD9.0-P4.00-D0.6-FD]  39.5 31.37 90 top
C1  10μF  [C0603]  16.8 25.25 90 top
C2  0.1μF  [C0603]  16.89 20.83 90 top
C3  10μF  [C0603]  36.7 15.88 0 top
C4  0.1μF  [C0603]  36.83 12.7 0 top
C5  22pF  [C0603]  32.51 9.4 0 top
C6  22pF  [C0603]  32.51 12.57 0 top
C7  100nF  [C0603]  32.77 16.13 0 top
C8  100nF  [C0603]  13.34 29.59 90 top
C9  100nF  [C0603]  10.29 16.13 90 top
C10  100nF  [C0603]  13.59 16.13 90 top
C11  100nF  [C0603]  16.76 16.13 90 top
C12  100nF  [C0603]  20.19 16.13 90 top
C13  100nF  [C0603]  42.36 20.84 0 top
C14  2.2μF  [C0603]  38.23 20.83 0 top
D1  1N4148W  [SOD-123_L2.7-W1.6-LS3.7-FD]  30.1 33.15 0 top
D2  1N4148W  [SOD-123_L2.7-W1.6-LS3.7-FD]  30.1 36.7 0 top
H1  PZ254V-11-04P  [HDR-TH_4P-P2.54-V-M]  18.29 33.15 90 top
H2  PZ2.54-2x3-11.2  [HDR-TH_6P-P2.54-V-M-R2-C3-S2.54]  11.3 8.38 90 top
H4  PZ254V-11-02P  [HDR-TH_2P-P2.54-V-M]  12.95 34.67 90 top
LDO1  AMS1117-3.3  [SOT-223-3_L6.5-W3.4-P2.30-LS7.0-BR]  9.14 24.13 0 top
Q1  SS8050  [SOT-23-3_L2.9-W1.3-P1.90-LS2.4-BR]  24 35.94 0 top
R1  10K  [R0603]  36.96 9.02 0 top
R2  10K  [R0603]  19.81 12.06 270 top
R3  10K  [R0603]  16.64 11.94 90 top
R5  1K  [R0603]  34.11 20.94 0 top
R6  1K  [R0603]  35.18 4.57 0 top
RESET1  TS-1101-C-W  [SW-SMD_L6.0-W3.3-LS8.0]  42.04 12.45 90 top
U1  STM32F103C8T6  [LQFP-48_L7.0-W7.0-P0.50-LS9.0-BL]  26.54 24.26 0 top
U2  2.54-2*4  [HDR-TH_8P-P2.54-V-F-R2-C4-S2.54]  22.73 6.86 180 top
U3  XL-TD2012SURC  [LED0805-RD_RED]  40.39 4.45 0 top
USB1  MicroXNJ  [MICRO-USB-SMD_MICROXNJ]  2.92 16 90 top
X1  8MHz  [CRYSTAL-SMD_L5.0-W3.2]  25.65 12.95 180 top

## Footprints (pads in the part's own frame, mm; a bottom-side part is the same pattern mirrored in y, then rotated)
BUZ-TH_BD9.0-P4.00-D0.6-FD
  round 1.8 hole 1: 1(-2,0) 2(2,0)
C0603
  rect 0.8x0.9 smd: 1(-0.7,0) 2(0.7,0)
CRYSTAL-SMD_L5.0-W3.2
  rect 1.9x2.4 smd: 1(-2.05,0) 2(2.05,0)
HDR-TH_2P-P2.54-V-M
  rect 2x2 hole 1.2: 1(-1.27,0)
  round 2 hole 1.2: 2(1.27,0)
HDR-TH_4P-P2.54-V-M
  rect 1.7x1.7 hole 1.1: 1(-3.81,0)
  round 1.7 hole 1.1: 2(-1.27,0) 3(1.27,0) 4(3.81,0)
HDR-TH_6P-P2.54-V-M-R2-C3-S2.54
  rect 1.7x1.7 hole 1.1: 1(-2.54,-1.27)
  round 1.7 hole 1.1: 2(-2.54,1.27) 3(0,-1.27) 4(0,1.27) 5(2.54,-1.27) 6(2.54,1.27)
HDR-TH_8P-P2.54-V-F-R2-C4-S2.54
  rect 1.6x1.6 hole 1.1: 1(-3.81,-1.27)
  round 1.6 hole 1.1: 2(-3.81,1.27) 3(-1.27,-1.27) 4(-1.27,1.27) 5(1.27,-1.27) 6(1.27,1.27) 7(3.81,-1.27) 8(3.81,1.27)
LED0805-RD_RED
  rect 1x1.25 smd: 1(-1.1,0) 2(1.1,0)
LQFP-48_L7.0-W7.0-P0.50-LS9.0-BL
  oval 0.27x1.5 smd: 1(-2.75,-4.25) 2(-2.25,-4.25) 3(-1.75,-4.25) 4(-1.25,-4.25) 5(-0.75,-4.25) 6(-0.25,-4.25) 7(0.25,-4.25) 8(0.75,-4.25) 9(1.25,-4.25) 10(1.75,-4.25) 11(2.25,-4.25) 12(2.75,-4.25) 25(2.75,4.25) 26(2.25,4.25) 27(1.75,4.25) 28(1.25,4.25) 29(0.75,4.25) 30(0.25,4.25) 31(-0.25,4.25) 32(-0.75,4.25) 33(-1.25,4.25) 34(-1.75,4.25) 35(-2.25,4.25) 36(-2.75,4.25)
  oval 1.5x0.27 smd: 13(4.25,-2.75) 14(4.25,-2.25) 15(4.25,-1.75) 16(4.25,-1.25) 17(4.25,-0.75) 18(4.25,-0.25) 19(4.25,0.25) 20(4.25,0.75) 21(4.25,1.25) 22(4.25,1.75) 23(4.25,2.25) 24(4.25,2.75) 37(-4.25,2.75) 38(-4.25,2.25) 39(-4.25,1.75) 40(-4.25,1.25) 41(-4.25,0.75) 42(-4.25,0.25) 43(-4.25,-0.25) 44(-4.25,-0.75) 45(-4.25,-1.25) 46(-4.25,-1.75) 47(-4.25,-2.25) 48(-4.25,-2.75)
MICRO-USB-SMD_MICROXNJ
  rect 0.4x1.6 smd: 1(-1.3,1.597) 2(-0.65,1.597) 3(0,1.597) 4(0.65,1.597) 5(1.3,1.597)
  round 1.3 hole 0.7: 6(2.425,1.074) 9(-2.425,1.073)
  oval 1.3x1.8 hole 0.7x1.1: 7(3.625,-1.597) 8(-3.625,-1.597)
R0603
  rect 0.806x0.864 smd: 1(-0.753,0) 2(0.753,0)
SOD-123_L2.7-W1.6-LS3.7-FD
  rect 0.88x0.96 smd: 1(-1.61,0) 2(1.61,0)
SOT-23-3_L2.9-W1.3-P1.90-LS2.4-BR
  rect 1.25x0.7 smd: 1(1,-0.95) 2(1,0.95) 3(-1,0)
SOT-223-3_L6.5-W3.4-P2.30-LS7.0-BR
  rect 2.5x1.1 smd: 1(2.97,-2.3) 2(2.97,0) 3(2.97,2.3)
  rect 2.34x3.6 smd: 4(-2.97,0)
SW-SMD_L6.0-W3.3-LS8.0
  rect 1.9x1.5 smd: 1(-4,0) 2(4,0)

## Nets
As in the schematic.

Pads without a net: LDO1 2; U1 1 2 3 4 10 11 12 13 14 15 16 17 18 19 21 22 25 32 33 38 39 40 41 43 45; USB1 2 3 4 6 7 8 9

## Via types
v1: diameter 0.61, hole 0.305, Top Layer to Bottom Layer, 33 vias

## Routing (per net, layer and track width the routed paths; a pad name or vN(x,y) marks a point on that pad's centre or on a via; arc(x,y) is an arc through that point)
+5V: length 44.8
  Top Layer w0.254: H4.2 9.4,32.39 9.4,29.15 LDO1.3 ; LDO1.3 4.97,26.43 4.39,25.86 4.39,21.07 3.34,20.01 3.34,15.66 2.38,14.7 USB1.1 ; LDO1.3 12.69,26.43 14.56,24.55 C1.1 16.8,23.91 15.37,22.48 15.37,20.7 15.93,20.14 16.88,20.14 C2.1
GND: length 57
  Top Layer w0.254: U1.47 20.83,22.01 20.28,21.46 v1(20.07,21.46) ; v1(21.08,20.45) 24.13,17.4 26.42,17.4 26.59,17.58 26.65,17.58 27,17.92 27,17.98 27.29,18.28 U1.8 ; C5.2 31.72,7.91 31.36,7.91 30.23,9.04 30.23,9.59 C6.2 ; C5.2 35.18,7.43 35.18,3.94 36.07,3.05 37.89,3.05 U3.1 ; C5.2 v1(34.64,9.4) ; U1.35 24.29,30.19 v1(23.75,30.73) ; C12.1 v1(20.19,14.15) ; C2.2 v1(18.29,21.53) ; v1(35.81,11.18) 36.13,11.49 C4.1 ; 32.26,26.16 31.91,26.51 U1.23
  Bottom Layer w0.254: v1(35.81,11.18) 35.81,10.03 35.18,9.4 v1(34.64,9.4) ; v1(20.19,14.15) 21.51,14.15 23.11,15.75 23.11,16.89 21.08,18.92 v1(21.08,20.45) v1(20.07,21.46) 20,21.53 v1(18.29,21.53)
  vias: v1(32.26,26.04)
VCC: length 130.6
  Top Layer w0.254: U1.9 27.88,19.92 27.88,19.22 27.89,19.21 27.89,17.74 26.98,16.83 C12.2 ; C12.2 C11.2 C10.2 C9.2 10.29,20.02 LDO1.4 ; C12.2 20.23,16.79 v1(21.84,16.79) 21.84,11.18 16.51,5.84 H2.1 H2.2 ; C12.2 20.27,16.9 20.27,20.78 21,21.51 U1.48 23.54,21.51 24.64,22.61 24.64,25.78 23.32,27.1 23.32,27.18 21.16,29.34 19.94,29.34 ; 35.49,29.37 D1.2 ; 35.49,29.37 BUZZER1.1 43.06,25.8 C13.2 43.06,19.82 41.4,18.16 39.69,18.16 C3.2 37.53,15.75 C4.2 37.71,12.52 R1.2 ; 35.49,29.37 33.12,27.01 U1.24 24.3,27.01 23.79,27.52 U1.36 23.79,29.67 23.03,30.44 21.04,30.44 19.94,29.34 ; 19.94,29.34 H1.1 18.03,29.08 15.49,29.08 14.29,30.29 C8.2
BOOT0: length 15.9
  Top Layer w0.254: U1.44 v1(20.32,23.51) ; R2.1 18.91,13.72 v1(18.29,13.72)
  Bottom Layer w0.254: v1(18.29,13.72) 17.4,14.61 17.4,21.72 19.18,23.5 20.31,23.5 v1(20.32,23.51)
BOOT1: length 33.4
  Top Layer w0.254: v1(14.48,13.21) 14.99,12.69 R3.2 ; v1(32.13,25.02) 32.12,25.01 U1.20
  Bottom Layer w0.254: v1(32.13,25.02) 31.12,26.04 16.64,26.04 15.37,24.77 15.37,14.1 v1(14.48,13.21)
LED_RED: length 61.6
  Top Layer w0.254: U1.42 v1(20.32,24.51) 19.18,23.36 19.18,19.56 18.54,18.92 v1(11.53,18.92) ; v1(9.14,18.92) 7.62,17.4 7.62,5.06 6.81,4.24 6.81,3.99 6.99,3.81 33.66,3.81 R6.1
  Bottom Layer w0.254: v1(9.14,18.92) v1(11.53,18.92)
OSC_IN: length 27.1
  Top Layer w0.254: C6.1 31.5,12.57 29.21,10.29 26.27,10.29 X1.2 29.84,19.2 29.84,21.08 28.96,21.97 26.16,21.97 25.79,21.6 U1.5
OSC_OUT: length 20.5
  Top Layer w0.254: v1(25.4,18.29) 26.29,19.18 U1.6 ; C5.1 34.34,11.93 34.34,13.16 33.66,13.84 28.59,13.84 X1.1 27.69,12.97 v1(27.69,15.75)
  Bottom Layer w0.254: v1(27.69,15.75) 25.4,18.03 v1(25.4,18.29)
PB9: length 17.7
  Top Layer w0.254: R5.1 33.36,19.89 v1(32.64,19.18) ; U1.46 v1(20.32,22.51)
  Bottom Layer w0.254: v1(32.64,19.18) 29.31,22.51 v1(20.32,22.51)
RESET: length 24.7
  Top Layer w0.254: v1(28.58,16.13) C7.1 34.93,13.27 34.93,10.3 R1.1 38.36,6.86 40.45,6.86 RESET1.1 ; v1(26.41,18.16) 26.71,18.46 26.71,19.92 U1.7
  Bottom Layer w0.254: v1(28.58,16.13) 28.44,16.13 v1(26.41,18.16)
SPI2_CE: length 61.4
  Top Layer w0.254: v1(32.54,34.19) 31,34.19 27.29,30.48 U1.29
  Bottom Layer w0.254: U2.6 21.46,3.17 22.35,2.29 32.13,2.29 37.34,7.49 37.34,32.77 34.54,35.56 33.91,35.56 v1(32.54,34.19)
SPI2_CSN: length 46
  Top Layer w0.254: U1.30 26.79,31.24 ; v1(26.79,31.46) 24.93,31.46 23.25,33.15 v1(21.08,33.15)
  Bottom Layer w0.254: U2.5 17.53,12.06 14.35,12.06 12.32,14.1 12.32,28.7 16.76,33.15 v1(21.08,33.15)
SPI2_IRQ: length 52.6
  Top Layer w0.254: v1(26.21,30.48) 26.21,28.59 U1.31
  Bottom Layer w0.254: v1(26.21,30.48) 26.29,30.56 26.29,30.61 26.21,30.7 26.21,33.19 26.62,33.6 33.71,33.6 34.93,32.39 34.93,11.43 27.17,3.67 25.98,3.67 25.15,4.51 25.15,6.86 26.42,8.13
SPI2_MISO: length 35.8
  Top Layer w0.254: U1.27 28.29,29.44 v1(29.08,30.23)
  Bottom Layer w0.254: 26.42,5.59 33.91,13.08 33.91,30.99 33.73,31.17 30.02,31.17 v1(29.08,30.23)
SPI2_MOSI: length 57.7
  Top Layer w0.254: v1(34.86,34.23) 34.23,34.23 v1(33.02,33.02) ; U1.28 27.79,29.95 v1(28.32,30.48)
  Bottom Layer w0.254: U2.3 22.61,6.73 22.61,3.17 22.79,3 29.41,3 36.96,10.54 36.96,32.13 v1(34.86,34.23) ; 32.89,32.89 31.52,31.52 29.55,31.52 28.51,30.48 v1(28.32,30.48)
SPI2_SCK: length 34.3
  Top Layer w0.254: v1(30.3,29.54) 29.12,29.54 28.79,29.21 U1.26
  Bottom Layer w0.254: U2.4 24,6.35 25.15,7.49 25.15,8.89 26.34,10.09 29.84,10.09 33.22,13.46 33.22,28.25 31.93,29.54 v1(30.3,29.54)
SWCLK: length 21.6
  Top Layer w0.254: U1.37 14.9,27.01 14.22,27.69 12.45,27.69 11.81,28.32 11.81,30.99 12.45,31.62 15.49,31.62 H1.3
SWDIO: length 9.4
  Top Layer w0.254: H1.2 24,31.88 24.77,31.12 24.77,28.54 U1.34
$1N1293: length 8.5
  Top Layer w0.254: H2.3 16.88,8.38 R2.2
$1N1294: length 7.8
  Top Layer w0.254: H2.4 10.98,8.38 12.11,9.51 14.96,9.51 R3.1
$1N1742: length 20.4
  Top Layer w0.254: Q1.3 23,33.89 24,32.89 28.24,32.89 D1.1 28.85,33.15 30.63,34.92 35.05,34.92 36.61,33.37 BUZZER1.2
$1N1744: length 2.7
  Top Layer w0.254: R5.2 37.41,20.94 C14.1
$1N1746: length 35.9
  Top Layer w0.254: v1(43.69,24.38) 43.69,31.75 38.74,36.7 D2.2 30,34.99 Q1.1 ; C14.2 41.4,23.3 v1(41.4,24.51)
  Bottom Layer w0.254: v1(43.69,24.38) 43.56,24.51 v1(41.4,24.51)
$1N2216: length 6.8
  Top Layer w0.254: R6.2 37.33,5.97 39.96,5.97 41.49,4.45

## Copper pours and planes (outline as drawn; the poured copper is in the pictures)
GND on Top Layer: -0.38,41.66 47.75,41.66 47.75,-1.27 -0.38,-1.27

## Text on the board
Bottom Silkscreen Layer: https://github.com / /CQ-WuMing / /SmokeAlarmSystem
